# EAGLE schematic i4004-master (EAGLE 6.2), part 1 of 8
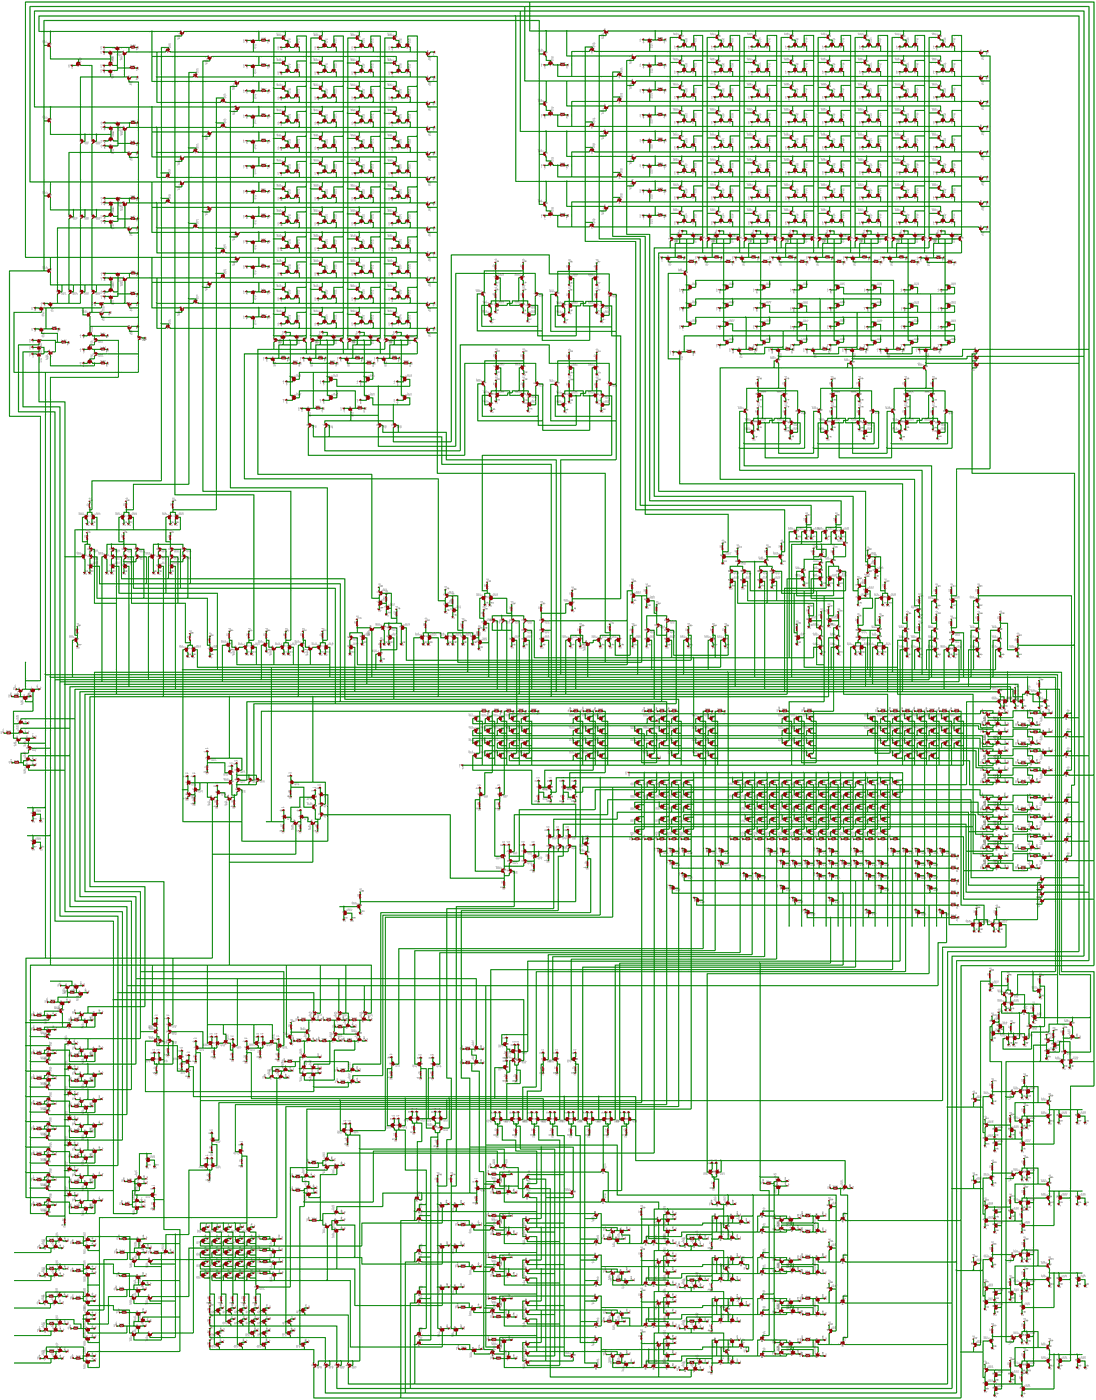
[diagram p0: schematic, sheet 1, overview]
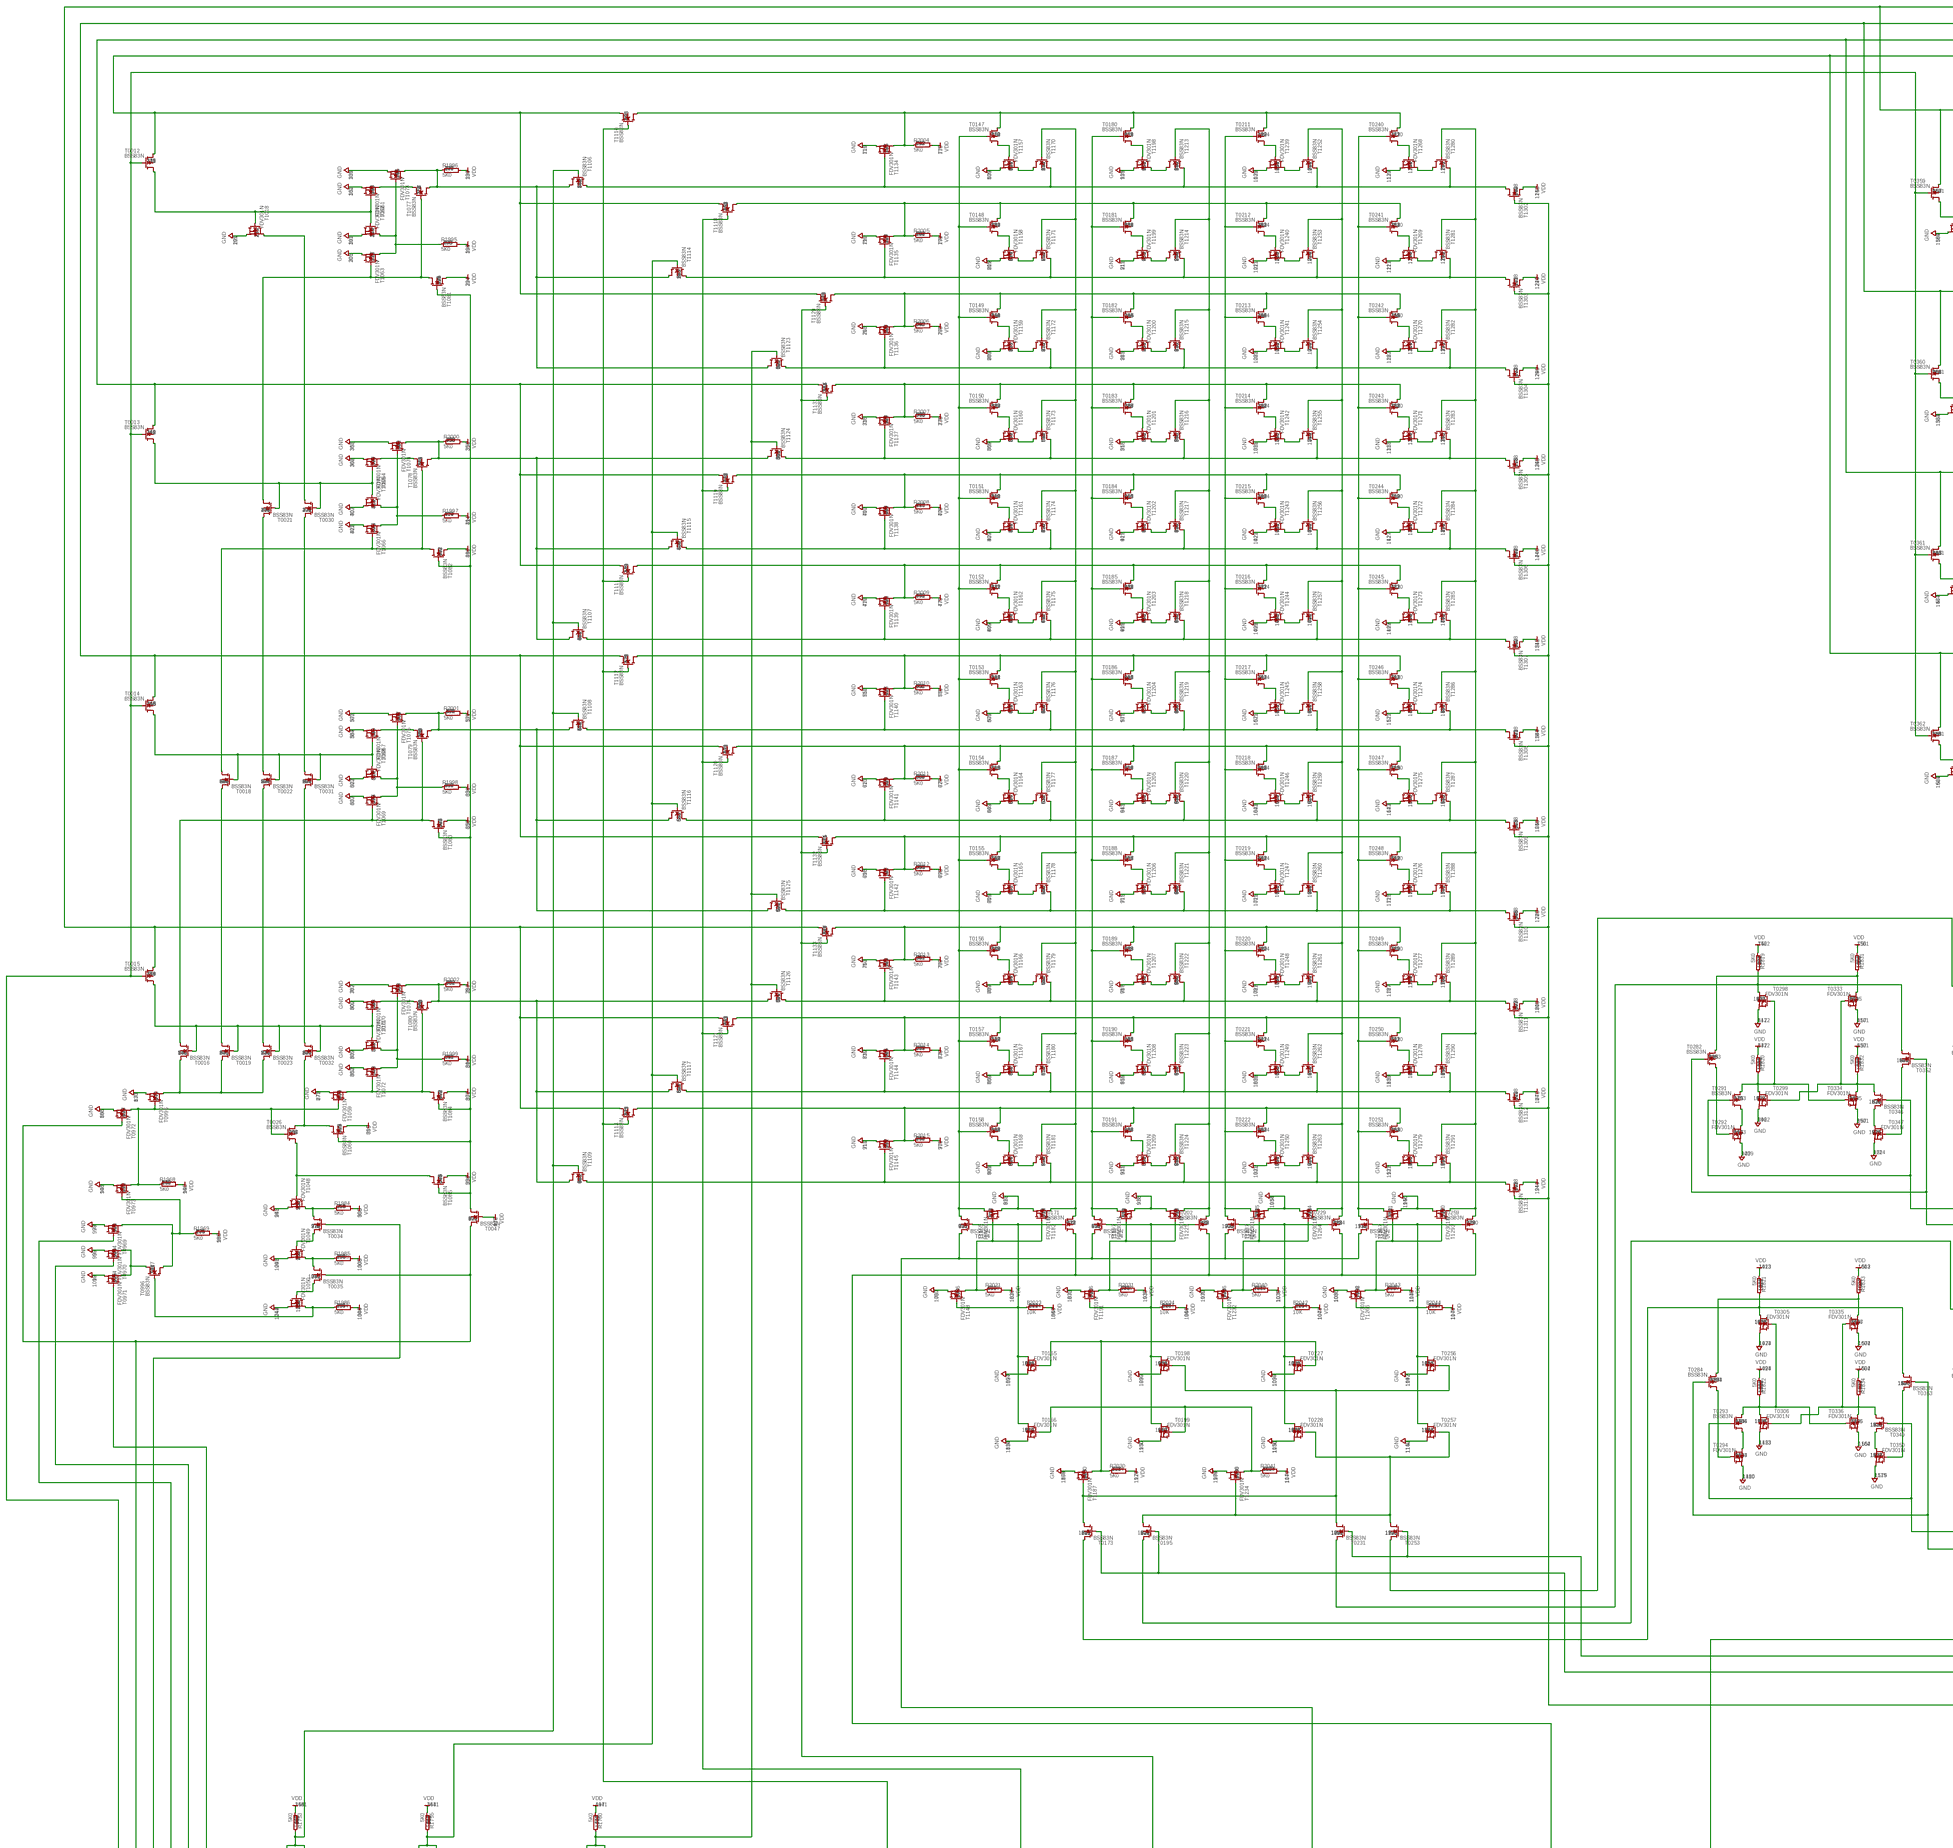
[diagram p1: schematic, sheet 1, part 1 of 6]
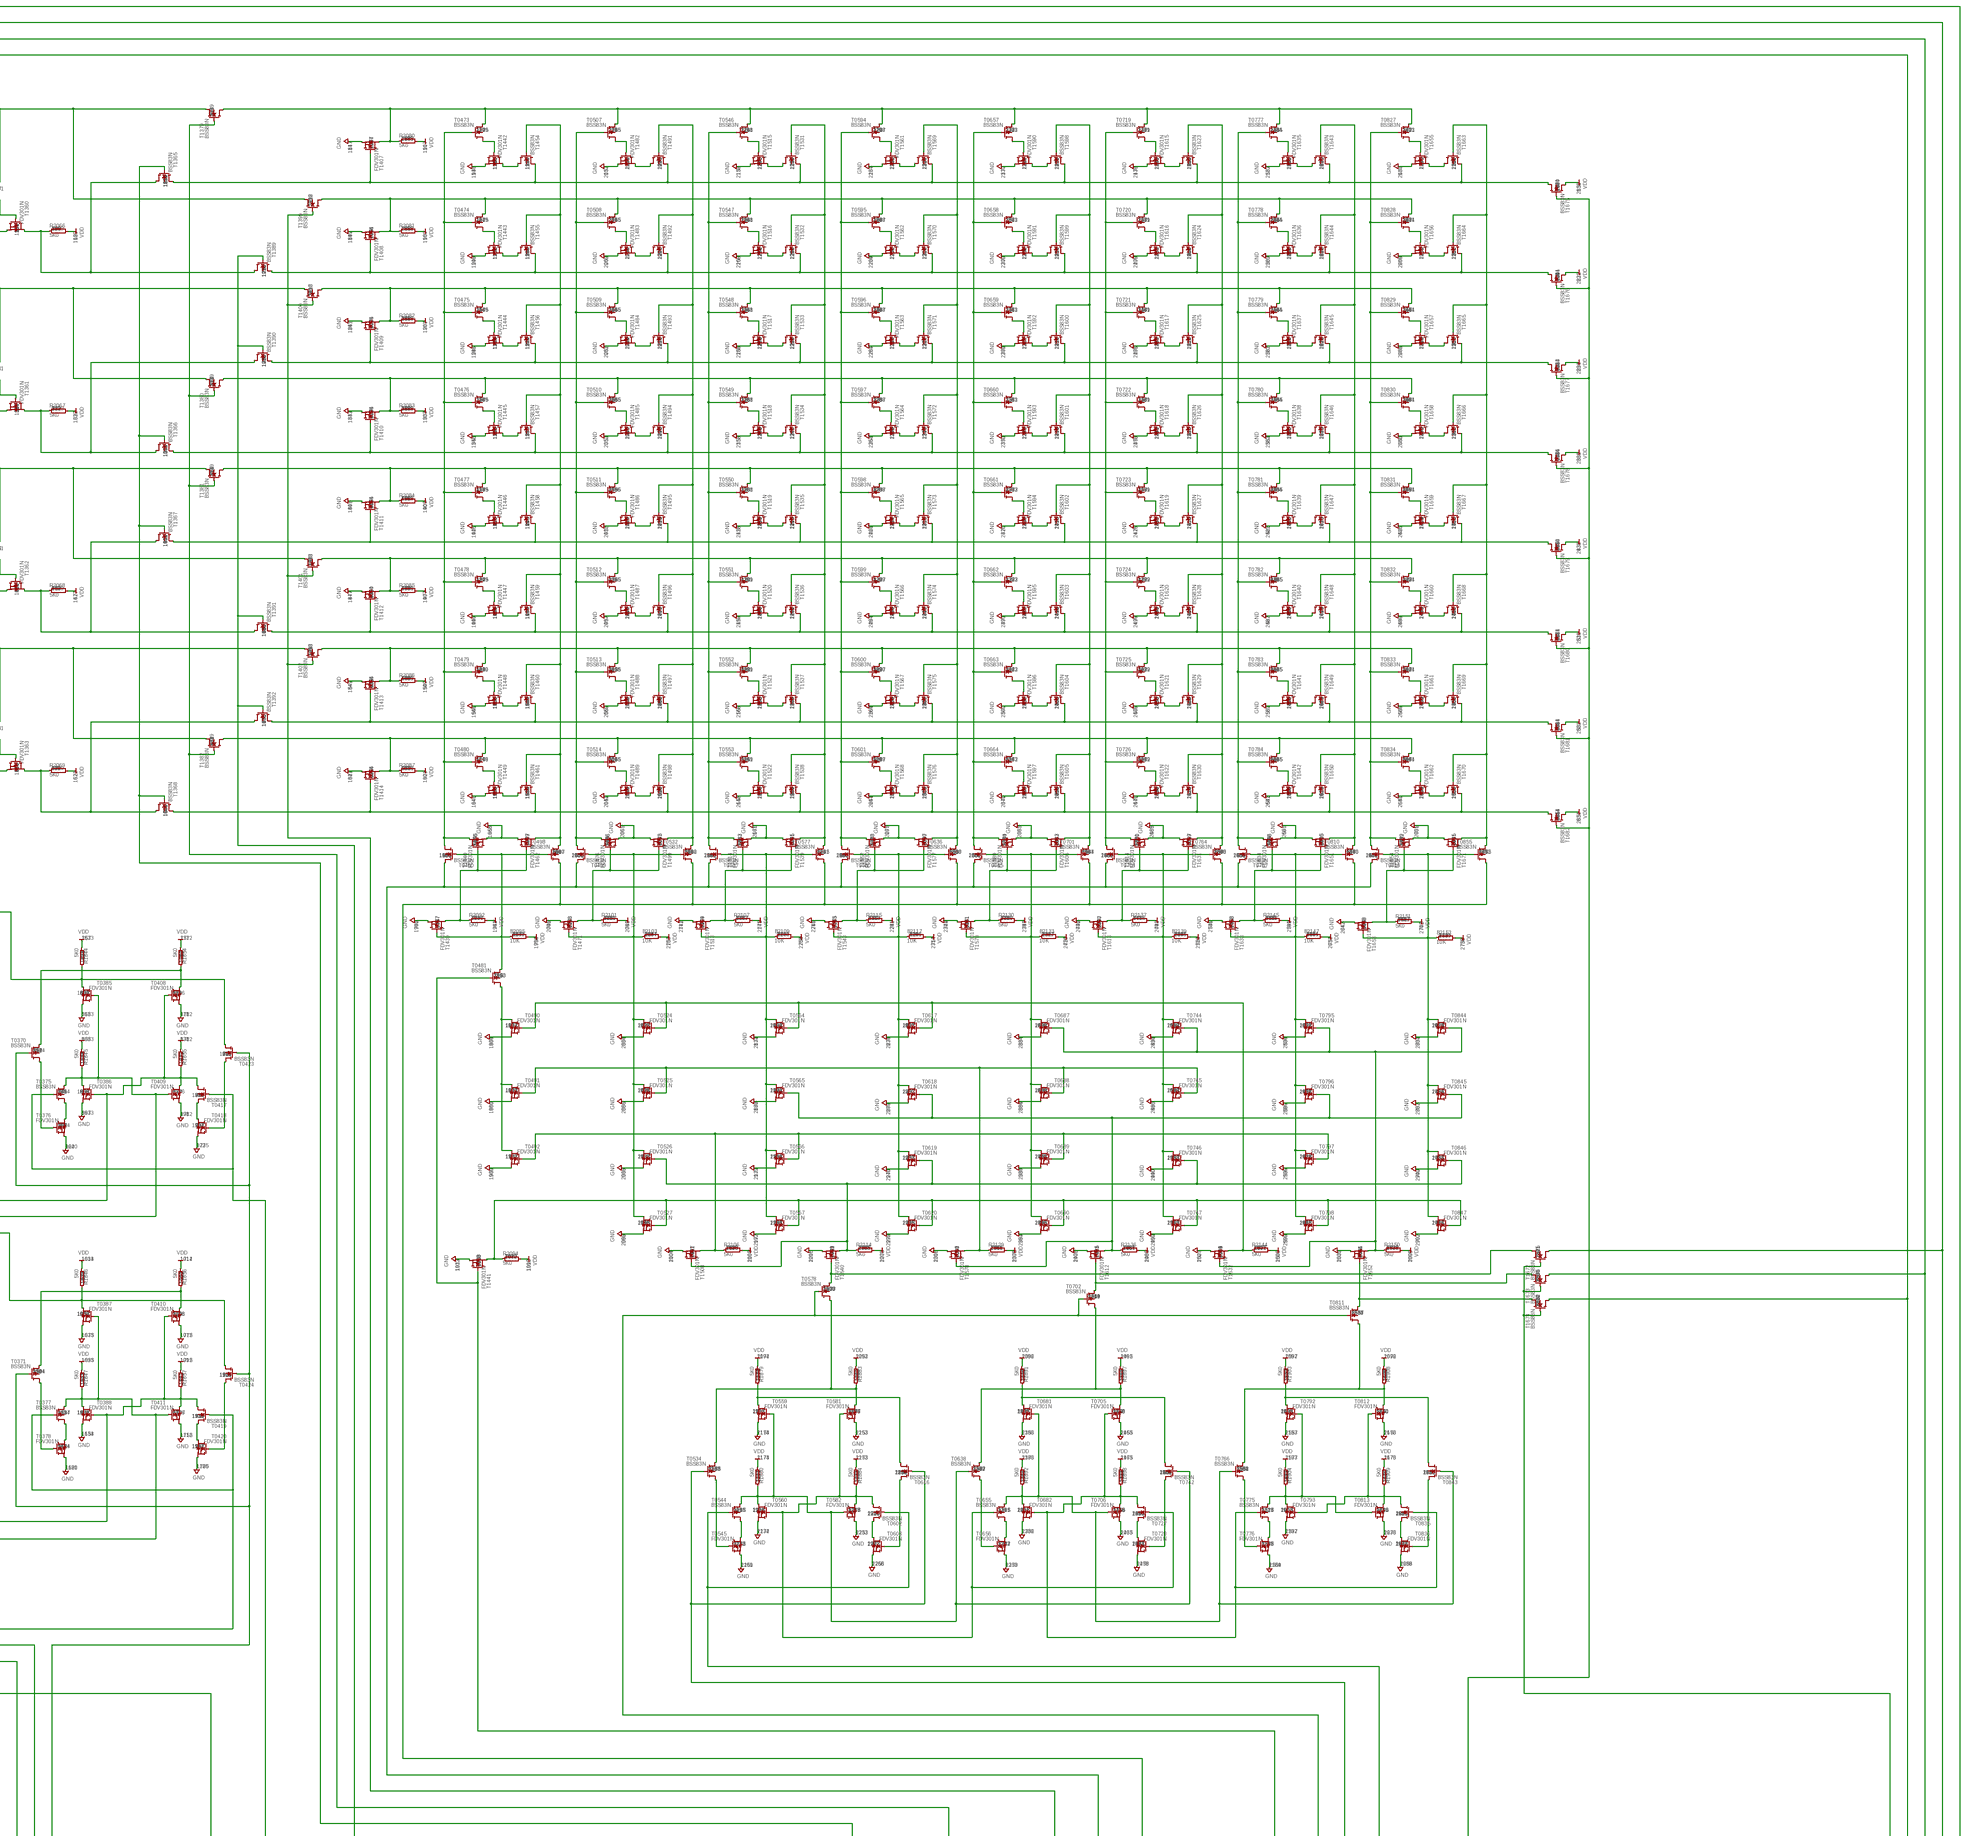
[diagram p2: schematic, sheet 1, part 2 of 6]
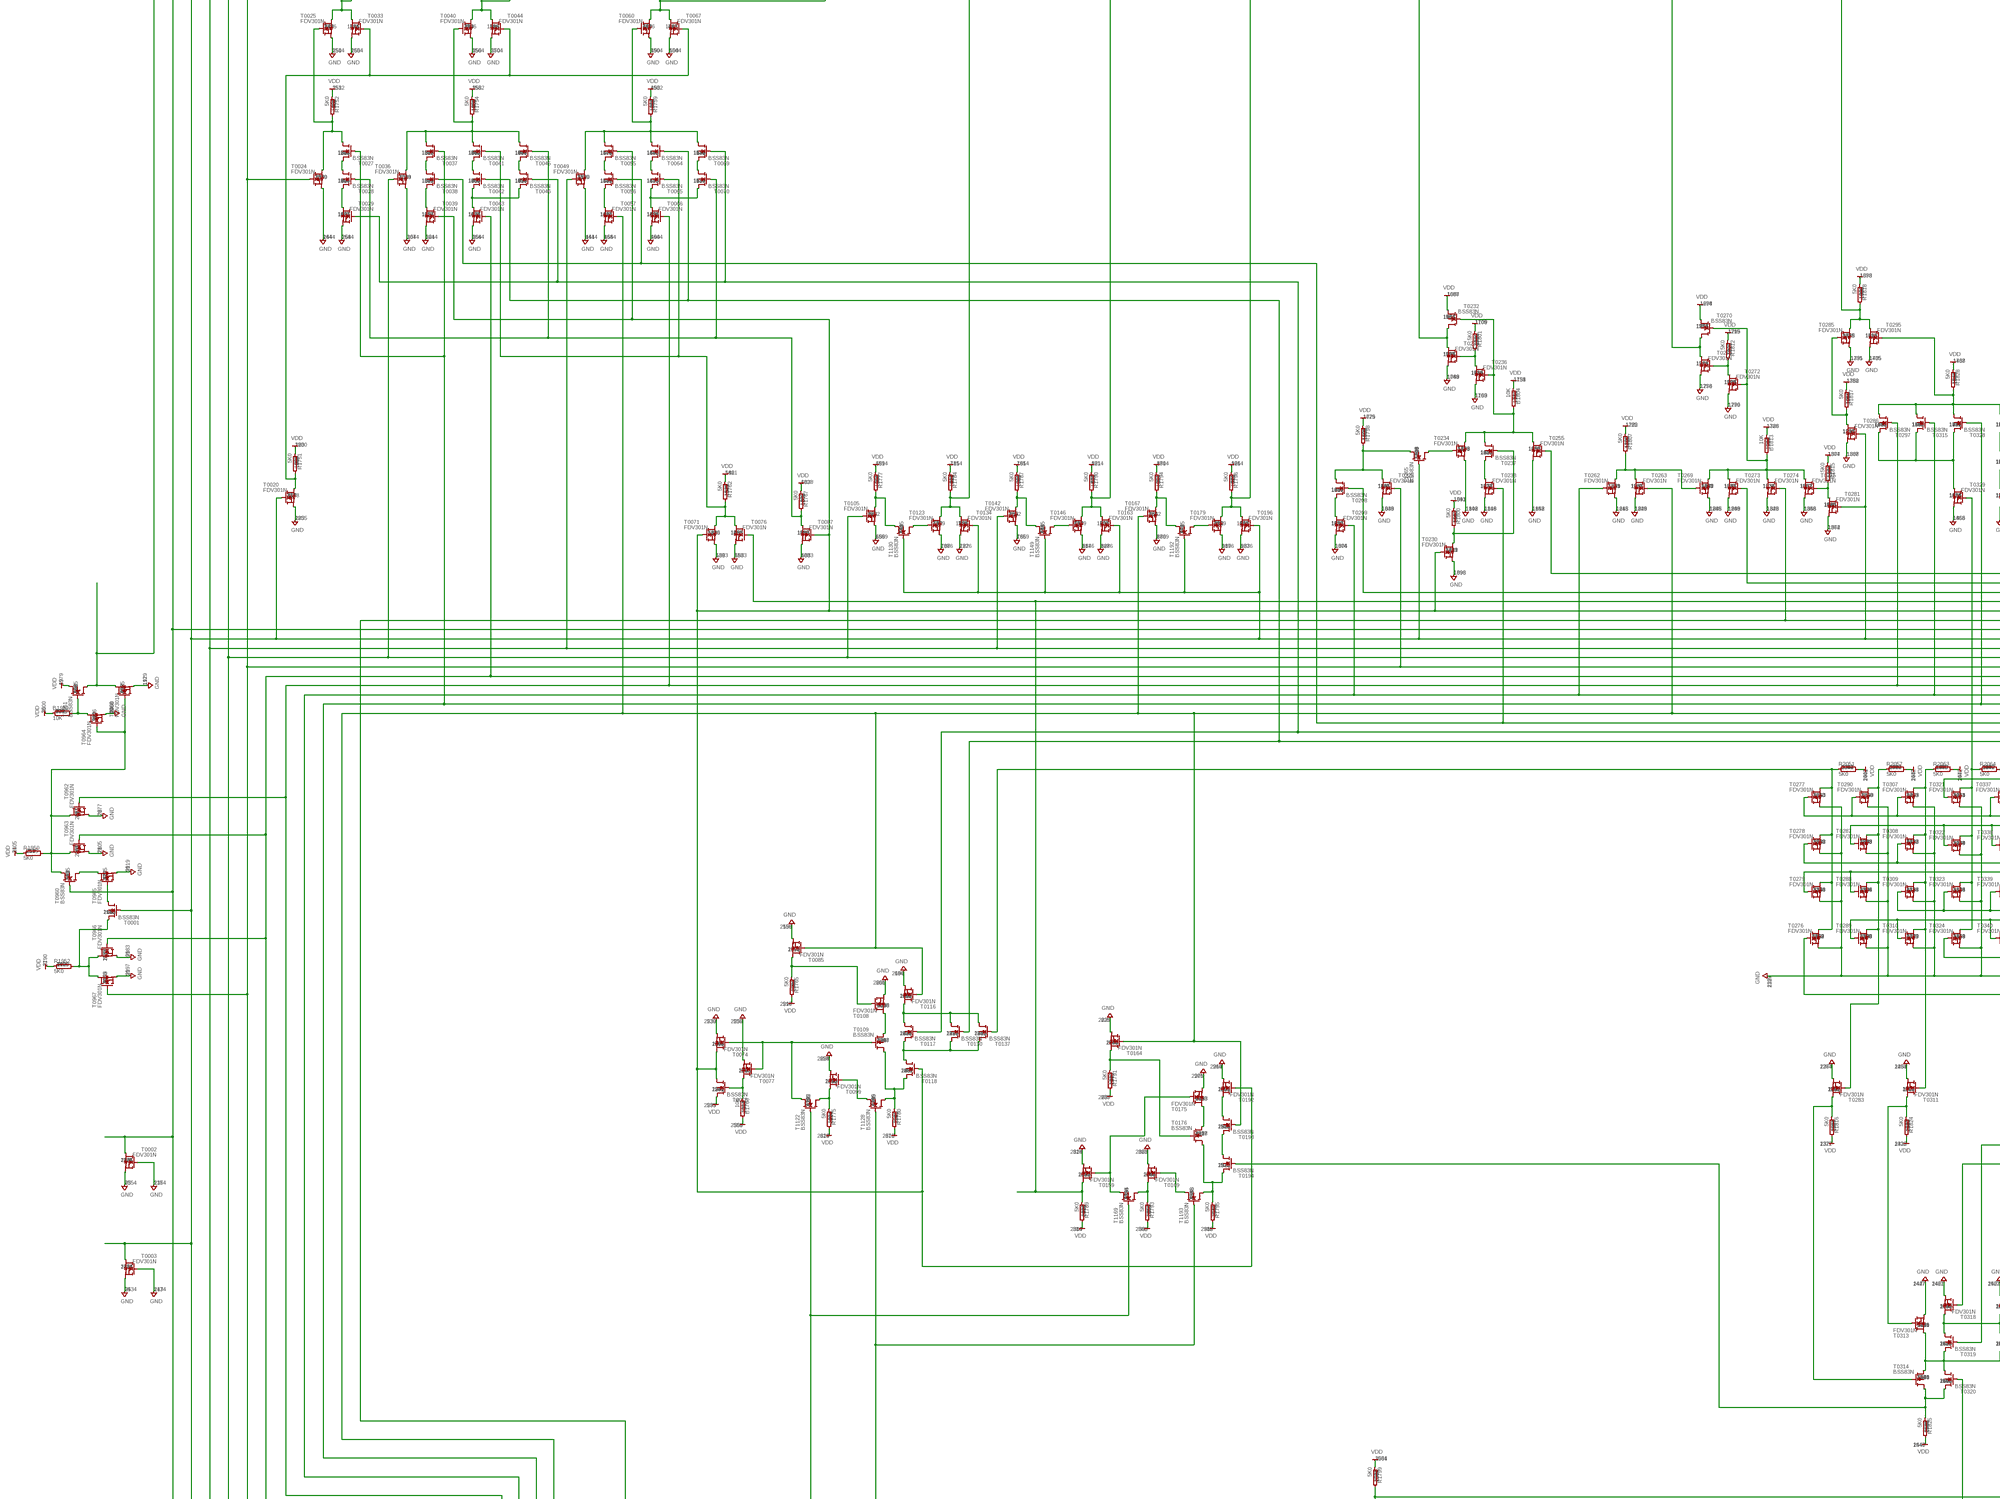
[diagram p3: schematic, sheet 1, part 3 of 6]
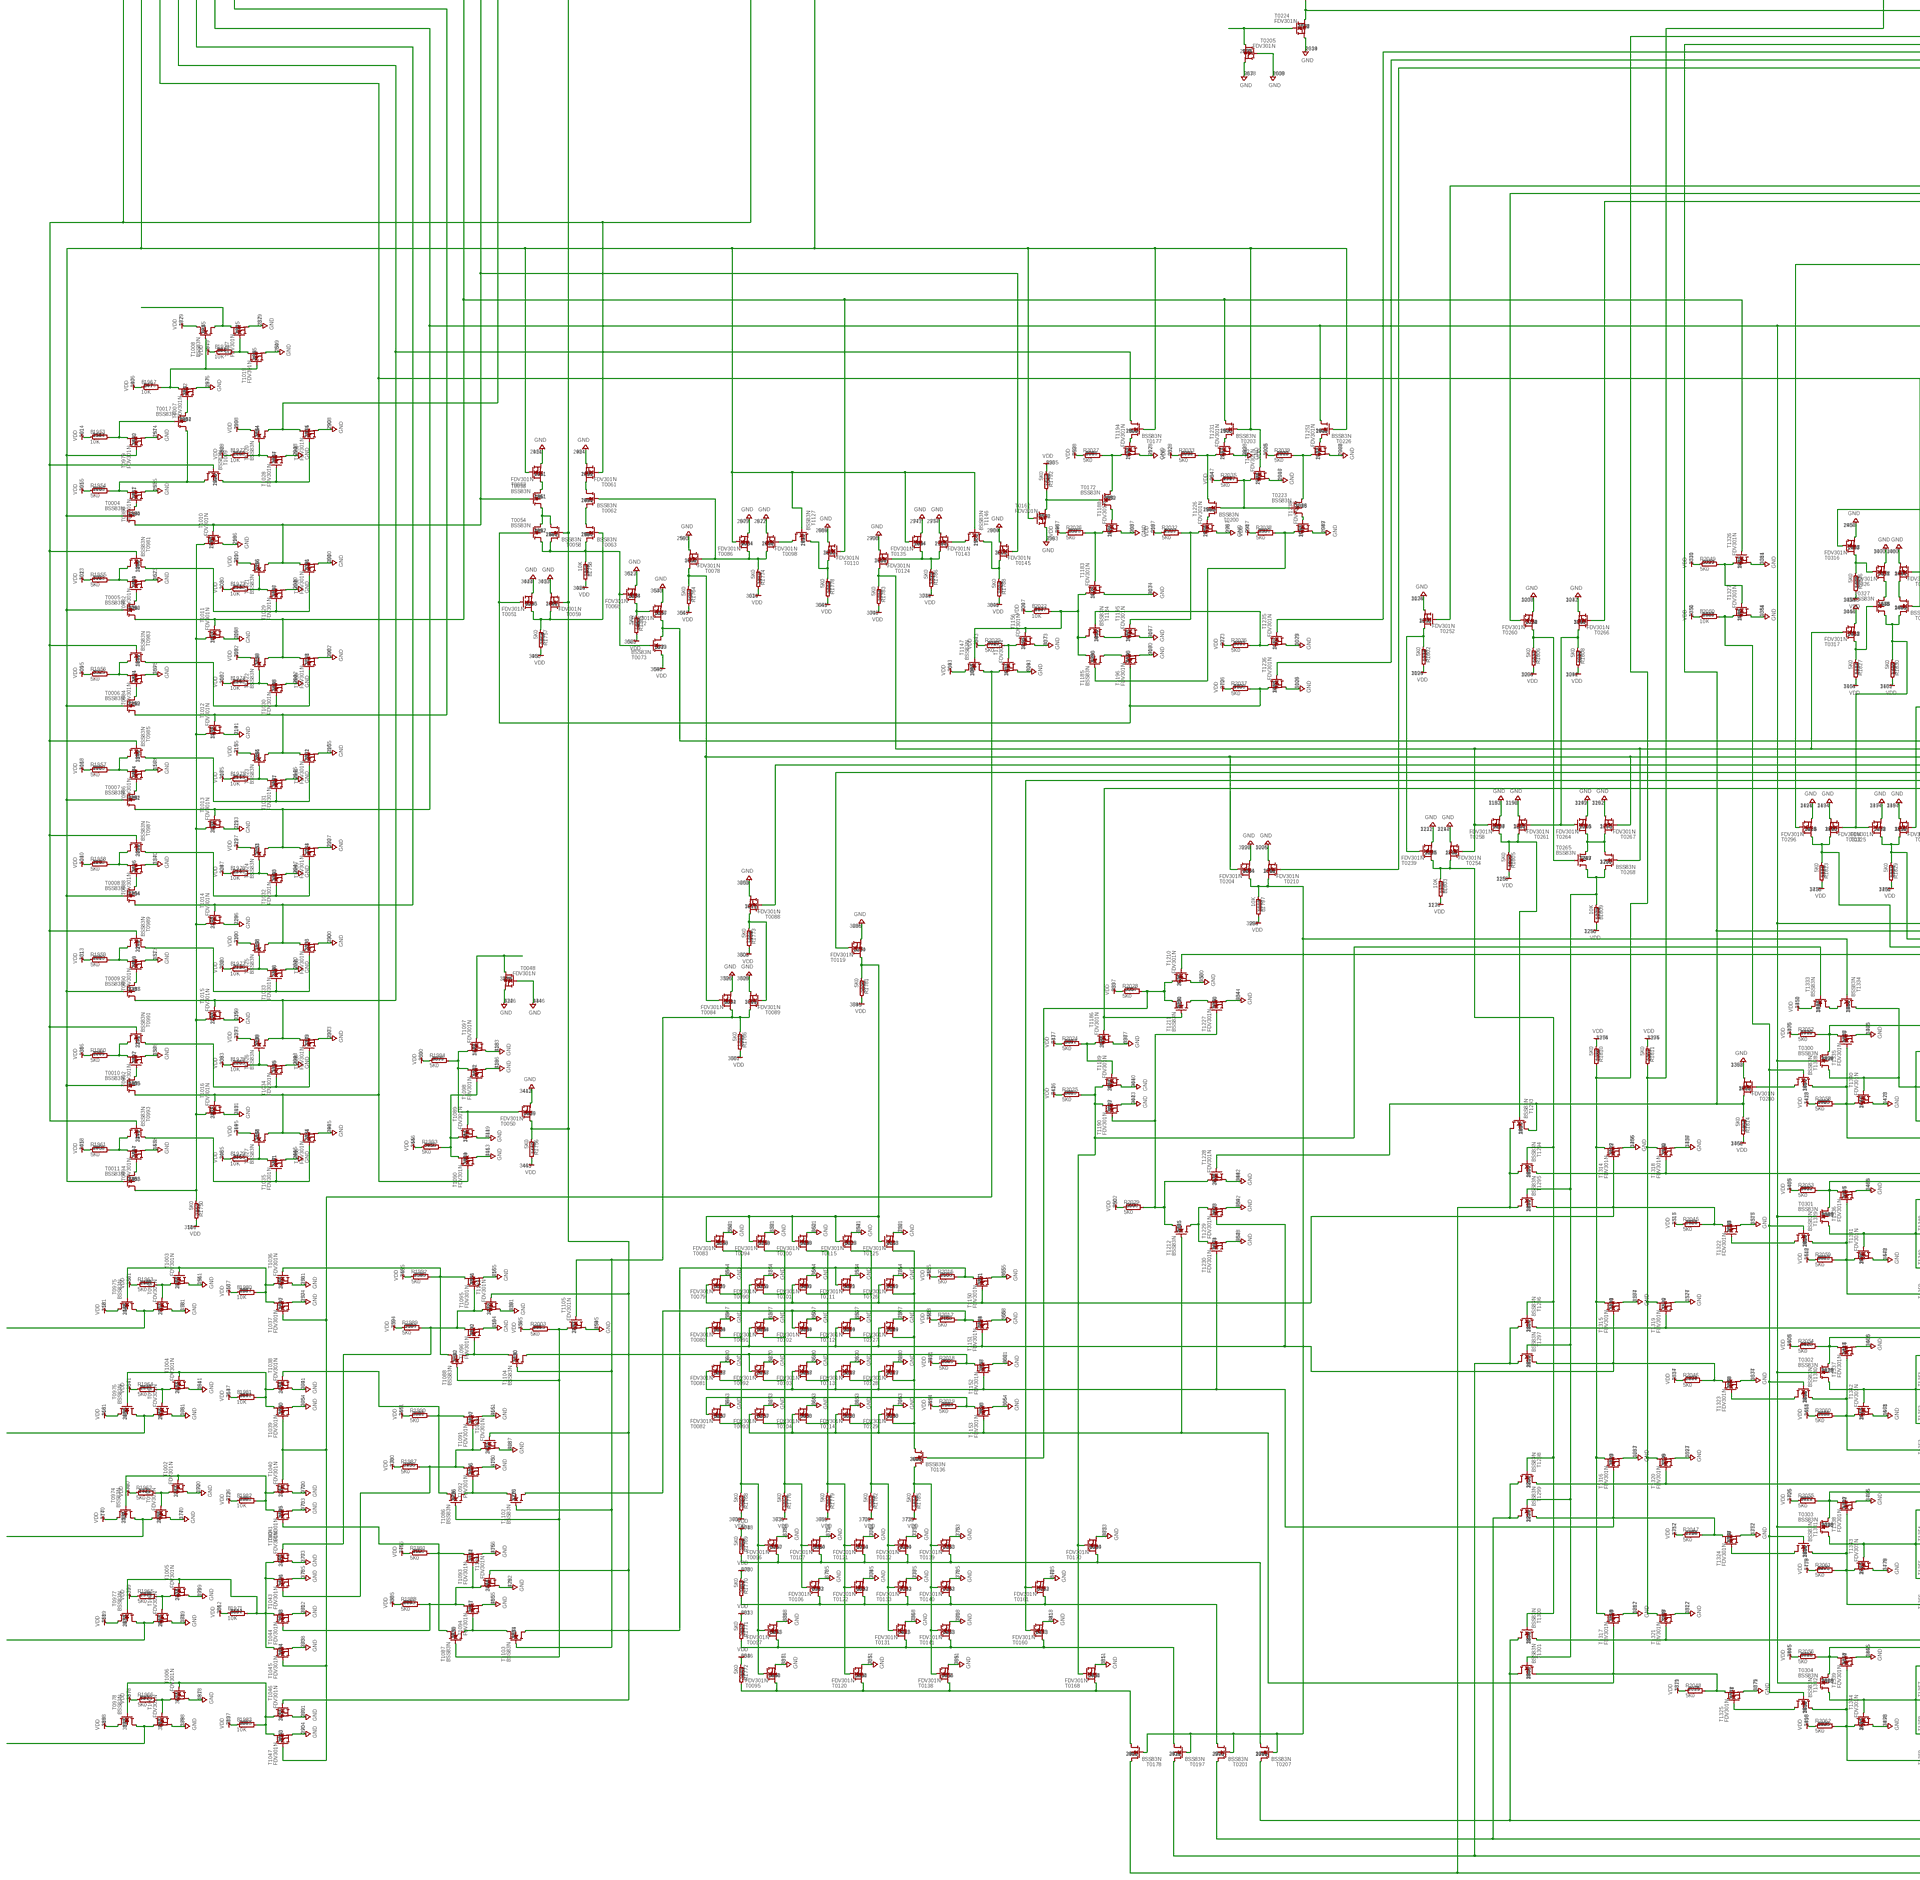
[diagram p4: schematic, sheet 1, part 4 of 6]
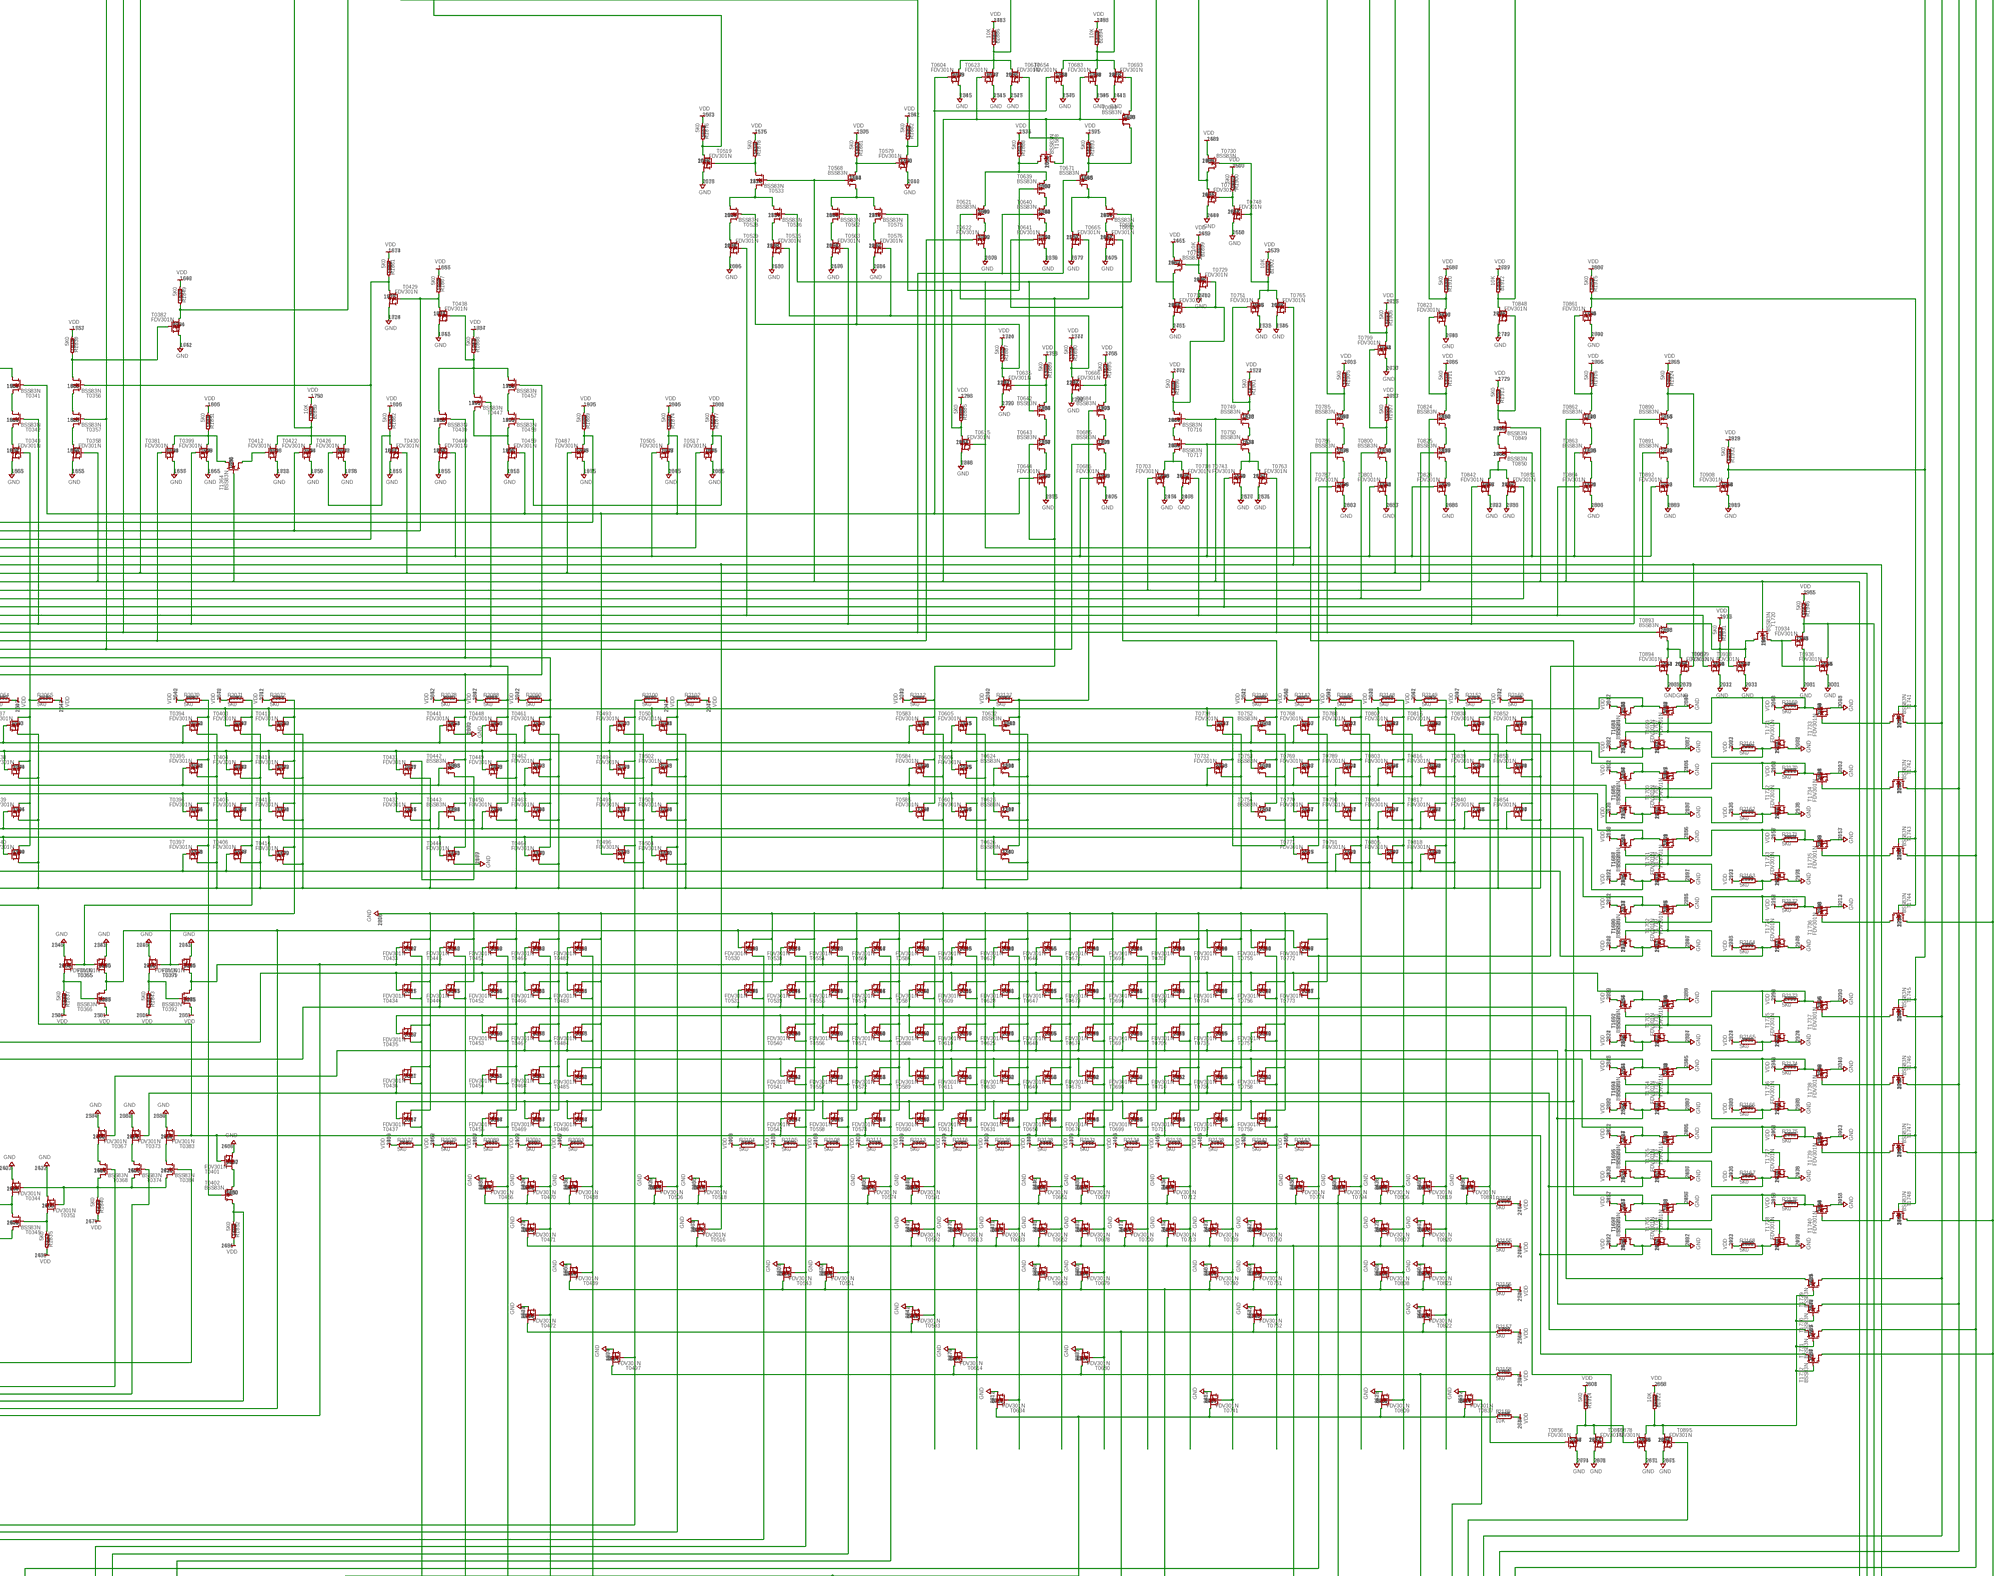
[diagram p5: schematic, sheet 1, part 5 of 6]
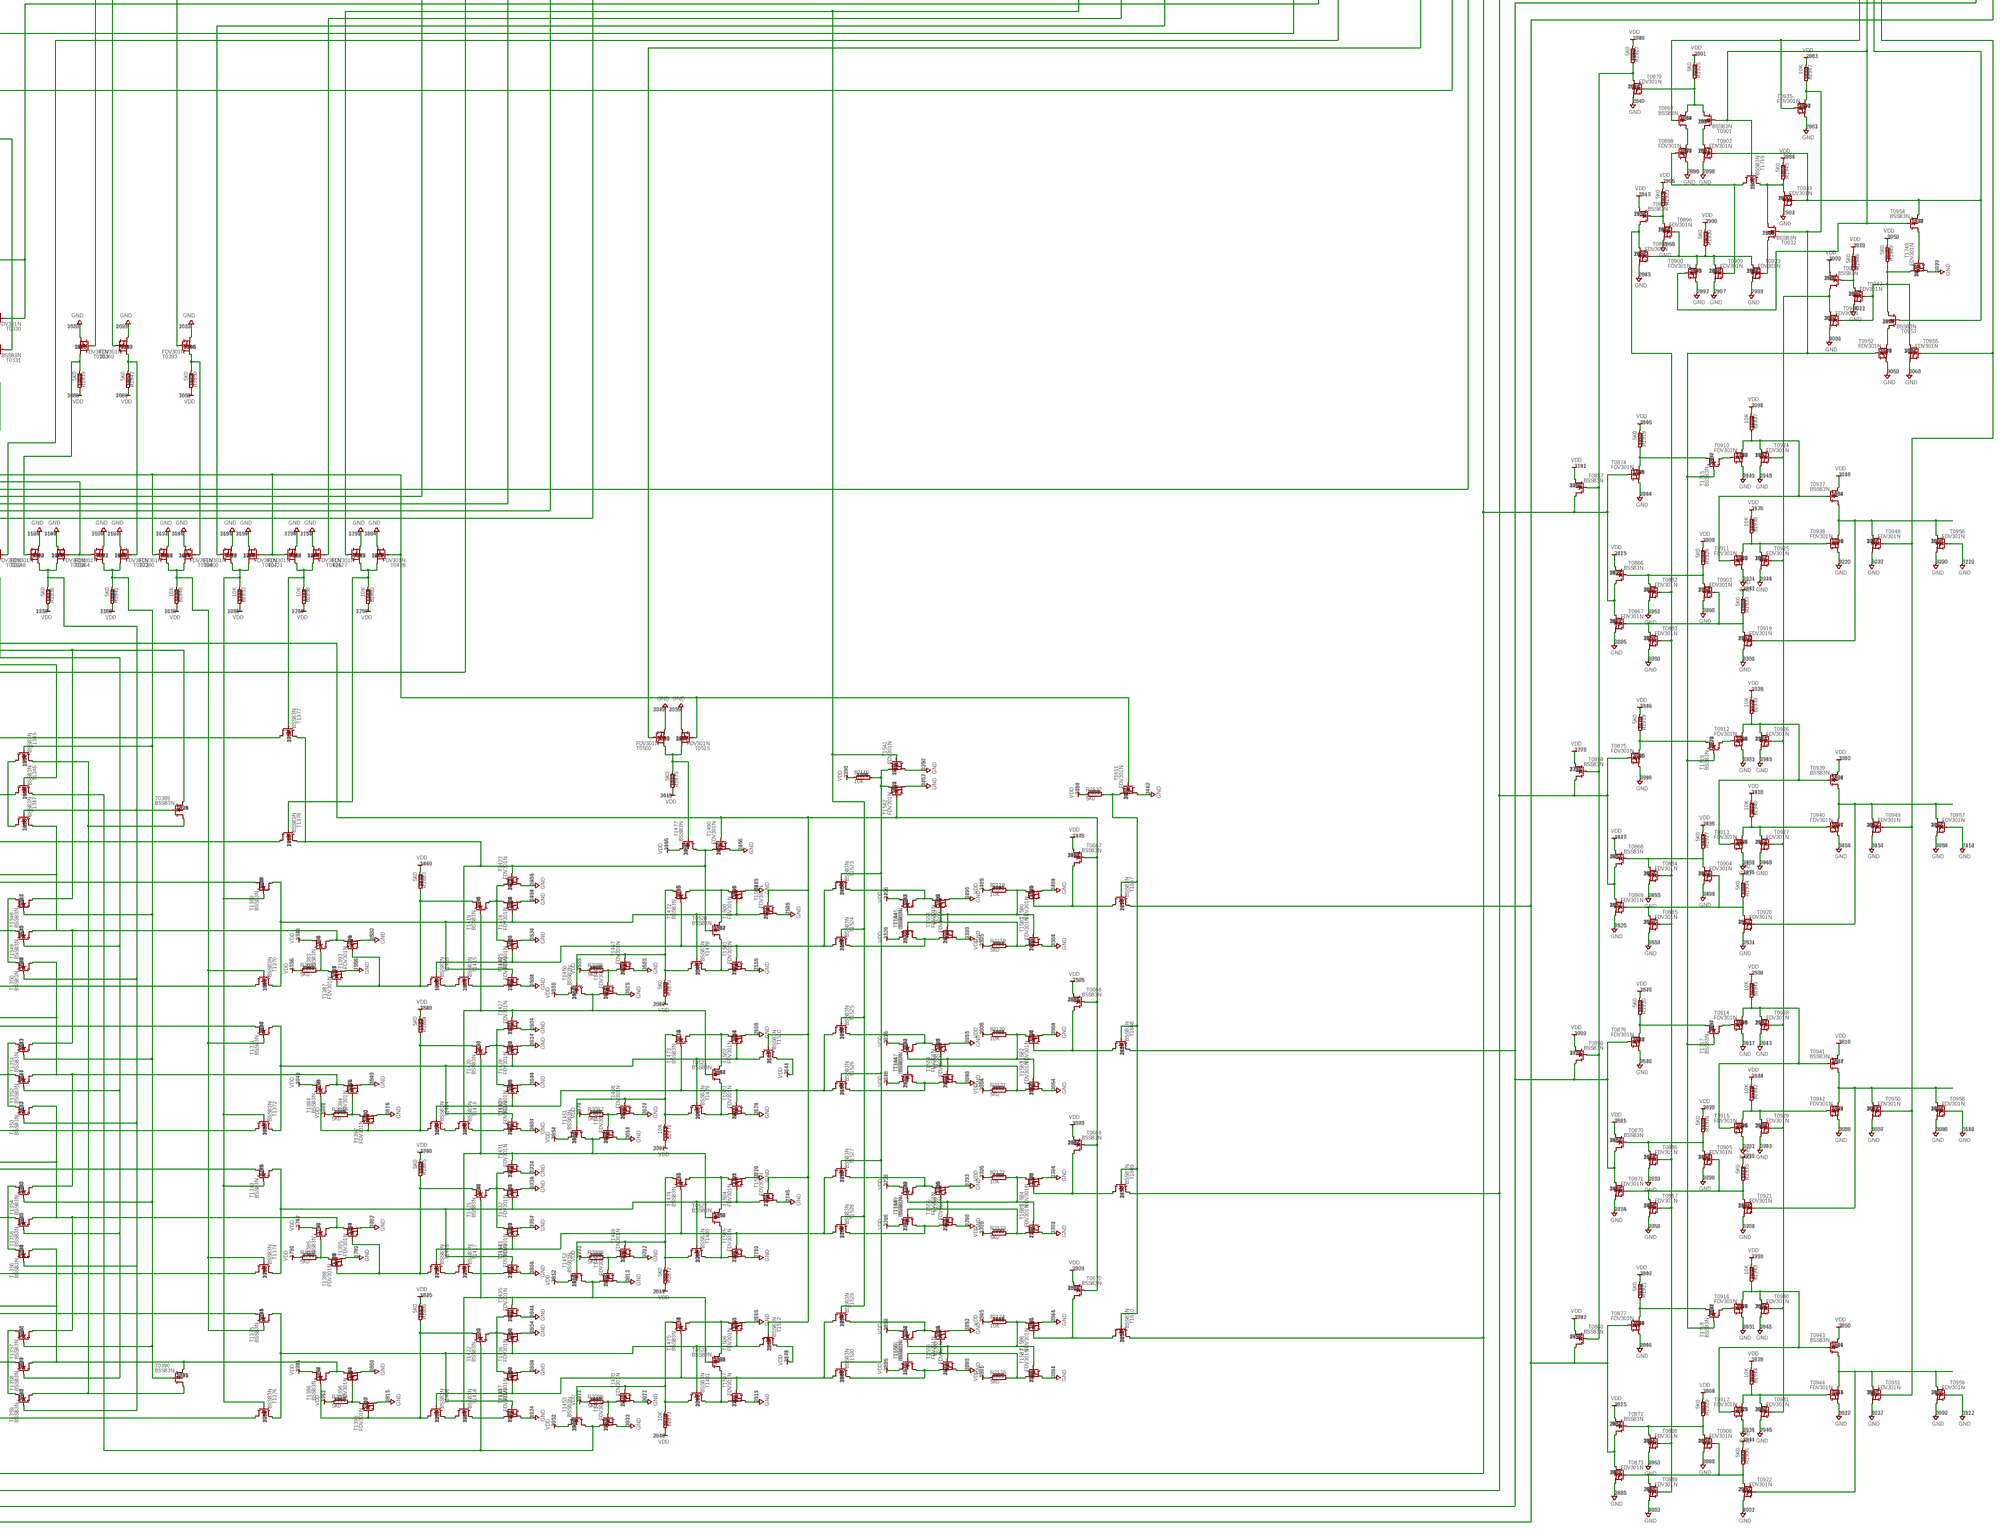
[diagram p6: schematic, sheet 1, part 6 of 6]

## Parts
B1758  10K  R-EU_R0805  [R0805]
B1763  10K  R-EU_R0805  [R0805]
B1797  10K  R-EU_R0805  [R0805]
B1803  10K  R-EU_R0805  [R0805]
B1804  10K  R-EU_R0805  [R0805]
B1809  10K  R-EU_R0805  [R0805]
B1813  10K  R-EU_R0805  [R0805]
B1848  10K  R-EU_R0805  [R0805]
B1853  10K  R-EU_R0805  [R0805]
B1858  10K  R-EU_R0805  [R0805]
B1859  10K  R-EU_R0805  [R0805]
B1860  10K  R-EU_R0805  [R0805]
B1871  10K  R-EU_R0805  [R0805]
B1873  10K  R-EU_R0805  [R0805]
B1886  10K  R-EU_R0805  [R0805]
B1894  10K  R-EU_R0805  [R0805]
B1899  10K  R-EU_R0805  [R0805]
B1902  10K  R-EU_R0805  [R0805]
B1912  10K  R-EU_R0805  [R0805]
B1922  10K  R-EU_R0805  [R0805]
B1937  10K  R-EU_R0805  [R0805]
B1938  10K  R-EU_R0805  [R0805]
B1939  10K  R-EU_R0805  [R0805]
B1940  10K  R-EU_R0805  [R0805]
B1941  10K  R-EU_R0805  [R0805]
B1942  10K  R-EU_R0805  [R0805]
B1943  10K  R-EU_R0805  [R0805]
B1944  10K  R-EU_R0805  [R0805]
B1947  10K  R-EU_R0805  [R0805]
B1951  10K  R-EU_R0805  [R0805]
B1953  10K  R-EU_R0805  [R0805]
B1967  10K  R-EU_R0805  [R0805]
B1970  10K  R-EU_R0805  [R0805]
B1971  10K  R-EU_R0805  [R0805]
B1972  10K  R-EU_R0805  [R0805]
B1973  10K  R-EU_R0805  [R0805]
B1974  10K  R-EU_R0805  [R0805]
B1975  10K  R-EU_R0805  [R0805]
B1976  10K  R-EU_R0805  [R0805]
B1977  10K  R-EU_R0805  [R0805]
B1978  10K  R-EU_R0805  [R0805]
B1979  10K  R-EU_R0805  [R0805]
B1980  10K  R-EU_R0805  [R0805]
B1981  10K  R-EU_R0805  [R0805]
B1982  10K  R-EU_R0805  [R0805]
B1983  10K  R-EU_R0805  [R0805]
B2022  10K  R-EU_R0805  [R0805]
B2023  10K  R-EU_R0805  [R0805]
B2034  10K  R-EU_R0805  [R0805]
B2042  10K  R-EU_R0805  [R0805]
B2044  10K  R-EU_R0805  [R0805]
B2050  10K  R-EU_R0805  [R0805]
B2095  10K  R-EU_R0805  [R0805]
B2103  10K  R-EU_R0805  [R0805]
B2109  10K  R-EU_R0805  [R0805]
B2110  10K  R-EU_R0805  [R0805]
B2117  10K  R-EU_R0805  [R0805]
B2118  10K  R-EU_R0805  [R0805]
B2120  10K  R-EU_R0805  [R0805]
B2122  10K  R-EU_R0805  [R0805]
B2124  10K  R-EU_R0805  [R0805]
B2133  10K  R-EU_R0805  [R0805]
B2139  10K  R-EU_R0805  [R0805]
B2147  10K  R-EU_R0805  [R0805]
B2153  10K  R-EU_R0805  [R0805]
B2159  10K  R-EU_R0805  [R0805]
R1750  5K0  R-EU_R0805  [R0805]
R1751  5K0  R-EU_R0805  [R0805]
R1752  5K0  R-EU_R0805  [R0805]
R1753  5K0  R-EU_R0805  [R0805]
R1754  5K0  R-EU_R0805  [R0805]
R1755  5K0  R-EU_R0805  [R0805]
R1756  5K0  R-EU_R0805  [R0805]
R1757  5K0  R-EU_R0805  [R0805]
R1759  5K0  R-EU_R0805  [R0805]
R1760  5K0  R-EU_R0805  [R0805]
R1761  5K0  R-EU_R0805  [R0805]
R1762  5K0  R-EU_R0805  [R0805]
R1764  5K0  R-EU_R0805  [R0805]
R1765  5K0  R-EU_R0805  [R0805]
R1766  5K0  R-EU_R0805  [R0805]
R1767  5K0  R-EU_R0805  [R0805]
R1768  5K0  R-EU_R0805  [R0805]
R1769  5K0  R-EU_R0805  [R0805]
R1770  5K0  R-EU_R0805  [R0805]
R1771  5K0  R-EU_R0805  [R0805]
R1772  5K0  R-EU_R0805  [R0805]
R1773  5K0  R-EU_R0805  [R0805]
R1774  5K0  R-EU_R0805  [R0805]
R1775  5K0  R-EU_R0805  [R0805]
R1776  5K0  R-EU_R0805  [R0805]
R1777  5K0  R-EU_R0805  [R0805]
R1778  5K0  R-EU_R0805  [R0805]
R1779  5K0  R-EU_R0805  [R0805]
R1780  5K0  R-EU_R0805  [R0805]
R1781  5K0  R-EU_R0805  [R0805]
R1782  5K0  R-EU_R0805  [R0805]
R1783  5K0  R-EU_R0805  [R0805]
R1784  5K0  R-EU_R0805  [R0805]
R1785  5K0  R-EU_R0805  [R0805]
R1786  5K0  R-EU_R0805  [R0805]
R1787  5K0  R-EU_R0805  [R0805]
R1788  5K0  R-EU_R0805  [R0805]
R1789  5K0  R-EU_R0805  [R0805]
R1790  5K0  R-EU_R0805  [R0805]
R1791  5K0  R-EU_R0805  [R0805]
R1792  5K0  R-EU_R0805  [R0805]
R1793  5K0  R-EU_R0805  [R0805]
R1794  5K0  R-EU_R0805  [R0805]
R1795  5K0  R-EU_R0805  [R0805]
R1796  5K0  R-EU_R0805  [R0805]
R1798  5K0  R-EU_R0805  [R0805]
R1799  5K0  R-EU_R0805  [R0805]
R1800  5K0  R-EU_R0805  [R0805]
R1801  5K0  R-EU_R0805  [R0805]
R1802  5K0  R-EU_R0805  [R0805]
R1805  5K0  R-EU_R0805  [R0805]
R1806  5K0  R-EU_R0805  [R0805]
R1807  5K0  R-EU_R0805  [R0805]
R1808  5K0  R-EU_R0805  [R0805]
R1810  5K0  R-EU_R0805  [R0805]
R1811  5K0  R-EU_R0805  [R0805]
R1812  5K0  R-EU_R0805  [R0805]
R1814  5K0  R-EU_R0805  [R0805]
R1815  5K0  R-EU_R0805  [R0805]
R1816  5K0  R-EU_R0805  [R0805]
R1817  5K0  R-EU_R0805  [R0805]
R1818  5K0  R-EU_R0805  [R0805]
R1819  5K0  R-EU_R0805  [R0805]
R1820  5K0  R-EU_R0805  [R0805]
R1821  5K0  R-EU_R0805  [R0805]
R1822  5K0  R-EU_R0805  [R0805]
R1823  5K0  R-EU_R0805  [R0805]
R1824  5K0  R-EU_R0805  [R0805]
R1825  5K0  R-EU_R0805  [R0805]
R1826  5K0  R-EU_R0805  [R0805]
R1827  5K0  R-EU_R0805  [R0805]
R1828  5K0  R-EU_R0805  [R0805]
R1829  5K0  R-EU_R0805  [R0805]
R1830  5K0  R-EU_R0805  [R0805]
R1831  5K0  R-EU_R0805  [R0805]
R1832  5K0  R-EU_R0805  [R0805]
R1833  5K0  R-EU_R0805  [R0805]
R1834  5K0  R-EU_R0805  [R0805]
R1835  5K0  R-EU_R0805  [R0805]
R1836  5K0  R-EU_R0805  [R0805]
R1837  5K0  R-EU_R0805  [R0805]
R1838  5K0  R-EU_R0805  [R0805]
R1839  5K0  R-EU_R0805  [R0805]
R1840  5K0  R-EU_R0805  [R0805]
R1841  5K0  R-EU_R0805  [R0805]
R1842  5K0  R-EU_R0805  [R0805]
R1843  5K0  R-EU_R0805  [R0805]
R1844  5K0  R-EU_R0805  [R0805]
R1845  5K0  R-EU_R0805  [R0805]
R1846  5K0  R-EU_R0805  [R0805]
R1847  5K0  R-EU_R0805  [R0805]
R1849  5K0  R-EU_R0805  [R0805]
R1850  5K0  R-EU_R0805  [R0805]
R1851  5K0  R-EU_R0805  [R0805]
R1852  5K0  R-EU_R0805  [R0805]
R1854  5K0  R-EU_R0805  [R0805]
R1855  5K0  R-EU_R0805  [R0805]
R1856  5K0  R-EU_R0805  [R0805]
R1857  5K0  R-EU_R0805  [R0805]
R1861  5K0  R-EU_R0805  [R0805]
R1862  5K0  R-EU_R0805  [R0805]
R1863  5K0  R-EU_R0805  [R0805]
R1864  5K0  R-EU_R0805  [R0805]
R1865  5K0  R-EU_R0805  [R0805]
R1866  5K0  R-EU_R0805  [R0805]
R1867  5K0  R-EU_R0805  [R0805]
R1868  5K0  R-EU_R0805  [R0805]
R1869  5K0  R-EU_R0805  [R0805]
R1870  5K0  R-EU_R0805  [R0805]
R1872  5K0  R-EU_R0805  [R0805]
R1874  5K0  R-EU_R0805  [R0805]
R1875  5K0  R-EU_R0805  [R0805]
R1876  5K0  R-EU_R0805  [R0805]
R1877  5K0  R-EU_R0805  [R0805]
R1878  5K0  R-EU_R0805  [R0805]
R1879  5K0  R-EU_R0805  [R0805]
R1880  5K0  R-EU_R0805  [R0805]
R1881  5K0  R-EU_R0805  [R0805]
R1882  5K0  R-EU_R0805  [R0805]
R1883  5K0  R-EU_R0805  [R0805]
R1884  5K0  R-EU_R0805  [R0805]
R1885  5K0  R-EU_R0805  [R0805]
R1887  5K0  R-EU_R0805  [R0805]
R1888  5K0  R-EU_R0805  [R0805]
R1889  5K0  R-EU_R0805  [R0805]
R1890  5K0  R-EU_R0805  [R0805]
R1891  5K0  R-EU_R0805  [R0805]
R1892  5K0  R-EU_R0805  [R0805]
R1893  5K0  R-EU_R0805  [R0805]
R1895  5K0  R-EU_R0805  [R0805]
R1896  5K0  R-EU_R0805  [R0805]
R1897  5K0  R-EU_R0805  [R0805]
R1898  5K0  R-EU_R0805  [R0805]
R1900  5K0  R-EU_R0805  [R0805]
R1901  5K0  R-EU_R0805  [R0805]
R1903  5K0  R-EU_R0805  [R0805]
R1904  5K0  R-EU_R0805  [R0805]
R1905  5K0  R-EU_R0805  [R0805]
R1906  5K0  R-EU_R0805  [R0805]
R1907  5K0  R-EU_R0805  [R0805]
R1908  5K0  R-EU_R0805  [R0805]
R1909  5K0  R-EU_R0805  [R0805]
R1910  5K0  R-EU_R0805  [R0805]
R1911  5K0  R-EU_R0805  [R0805]
R1913  5K0  R-EU_R0805  [R0805]
R1914  5K0  R-EU_R0805  [R0805]
R1915  5K0  R-EU_R0805  [R0805]
R1916  5K0  R-EU_R0805  [R0805]
R1917  5K0  R-EU_R0805  [R0805]
R1918  5K0  R-EU_R0805  [R0805]
R1919  5K0  R-EU_R0805  [R0805]
R1920  5K0  R-EU_R0805  [R0805]
R1921  5K0  R-EU_R0805  [R0805]
R1923  5K0  R-EU_R0805  [R0805]
R1924  5K0  R-EU_R0805  [R0805]
R1925  5K0  R-EU_R0805  [R0805]
R1926  5K0  R-EU_R0805  [R0805]
R1927  5K0  R-EU_R0805  [R0805]
R1928  5K0  R-EU_R0805  [R0805]
R1929  5K0  R-EU_R0805  [R0805]
R1930  5K0  R-EU_R0805  [R0805]
R1931  5K0  R-EU_R0805  [R0805]
R1932  5K0  R-EU_R0805  [R0805]
R1933  5K0  R-EU_R0805  [R0805]
R1934  5K0  R-EU_R0805  [R0805]
R1935  5K0  R-EU_R0805  [R0805]
R1936  5K0  R-EU_R0805  [R0805]
R1945  5K0  R-EU_R0805  [R0805]
R1946  5K0  R-EU_R0805  [R0805]
R1948  5K0  R-EU_R0805  [R0805]
R1949  5K0  R-EU_R0805  [R0805]
R1950  5K0  R-EU_R0805  [R0805]
R1952  5K0  R-EU_R0805  [R0805]
R1954  5K0  R-EU_R0805  [R0805]
R1955  5K0  R-EU_R0805  [R0805]
R1956  5K0  R-EU_R0805  [R0805]
R1957  5K0  R-EU_R0805  [R0805]
R1958  5K0  R-EU_R0805  [R0805]
R1959  5K0  R-EU_R0805  [R0805]
R1960  5K0  R-EU_R0805  [R0805]
R1961  5K0  R-EU_R0805  [R0805]
R1962  5K0  R-EU_R0805  [R0805]
R1963  5K0  R-EU_R0805  [R0805]
R1964  5K0  R-EU_R0805  [R0805]
R1965  5K0  R-EU_R0805  [R0805]
R1966  5K0  R-EU_R0805  [R0805]
R1968  5K0  R-EU_R0805  [R0805]
R1969  5K0  R-EU_R0805  [R0805]
R1984  5K0  R-EU_R0805  [R0805]
R1985  5K0  R-EU_R0805  [R0805]
R1986  5K0  R-EU_R0805  [R0805]
R1987  5K0  R-EU_R0805  [R0805]
R1988  5K0  R-EU_R0805  [R0805]
R1989  5K0  R-EU_R0805  [R0805]
R1990  5K0  R-EU_R0805  [R0805]
R1991  5K0  R-EU_R0805  [R0805]
R1992  5K0  R-EU_R0805  [R0805]
R1993  5K0  R-EU_R0805  [R0805]
R1994  5K0  R-EU_R0805  [R0805]
R1995  5K0  R-EU_R0805  [R0805]
R1996  5K0  R-EU_R0805  [R0805]
R1997  5K0  R-EU_R0805  [R0805]
R1998  5K0  R-EU_R0805  [R0805]
R1999  5K0  R-EU_R0805  [R0805]
R2000  5K0  R-EU_R0805  [R0805]
R2001  5K0  R-EU_R0805  [R0805]
R2002  5K0  R-EU_R0805  [R0805]
R2003  5K0  R-EU_R0805  [R0805]
R2004  5K0  R-EU_R0805  [R0805]
R2005  5K0  R-EU_R0805  [R0805]
R2006  5K0  R-EU_R0805  [R0805]
R2007  5K0  R-EU_R0805  [R0805]
R2008  5K0  R-EU_R0805  [R0805]
R2009  5K0  R-EU_R0805  [R0805]
R2010  5K0  R-EU_R0805  [R0805]
R2011  5K0  R-EU_R0805  [R0805]
R2012  5K0  R-EU_R0805  [R0805]
R2013  5K0  R-EU_R0805  [R0805]
R2014  5K0  R-EU_R0805  [R0805]
R2015  5K0  R-EU_R0805  [R0805]
R2016  5K0  R-EU_R0805  [R0805]
R2017  5K0  R-EU_R0805  [R0805]
R2018  5K0  R-EU_R0805  [R0805]
R2019  5K0  R-EU_R0805  [R0805]
R2020  5K0  R-EU_R0805  [R0805]
R2021  5K0  R-EU_R0805  [R0805]
R2024  5K0  R-EU_R0805  [R0805]
R2025  5K0  R-EU_R0805  [R0805]
R2026  5K0  R-EU_R0805  [R0805]
R2027  5K0  R-EU_R0805  [R0805]
R2028  5K0  R-EU_R0805  [R0805]
R2029  5K0  R-EU_R0805  [R0805]
R2030  5K0  R-EU_R0805  [R0805]
R2031  5K0  R-EU_R0805  [R0805]
R2032  5K0  R-EU_R0805  [R0805]
R2033  5K0  R-EU_R0805  [R0805]
R2035  5K0  R-EU_R0805  [R0805]
R2036  5K0  R-EU_R0805  [R0805]
R2037  5K0  R-EU_R0805  [R0805]
R2038  5K0  R-EU_R0805  [R0805]
R2039  5K0  R-EU_R0805  [R0805]
R2040  5K0  R-EU_R0805  [R0805]
R2041  5K0  R-EU_R0805  [R0805]
R2043  5K0  R-EU_R0805  [R0805]
R2045  5K0  R-EU_R0805  [R0805]
R2046  5K0  R-EU_R0805  [R0805]
R2047  5K0  R-EU_R0805  [R0805]
R2048  5K0  R-EU_R0805  [R0805]
R2049  5K0  R-EU_R0805  [R0805]
R2051  5K0  R-EU_R0805  [R0805]
R2052  5K0  R-EU_R0805  [R0805]
R2053  5K0  R-EU_R0805  [R0805]
R2054  5K0  R-EU_R0805  [R0805]
R2055  5K0  R-EU_R0805  [R0805]
R2056  5K0  R-EU_R0805  [R0805]
R2057  5K0  R-EU_R0805  [R0805]
R2058  5K0  R-EU_R0805  [R0805]
R2059  5K0  R-EU_R0805  [R0805]
R2060  5K0  R-EU_R0805  [R0805]
R2061  5K0  R-EU_R0805  [R0805]
R2062  5K0  R-EU_R0805  [R0805]
R2063  5K0  R-EU_R0805  [R0805]
R2064  5K0  R-EU_R0805  [R0805]
R2065  5K0  R-EU_R0805  [R0805]
R2066  5K0  R-EU_R0805  [R0805]
R2067  5K0  R-EU_R0805  [R0805]
R2068  5K0  R-EU_R0805  [R0805]
R2069  5K0  R-EU_R0805  [R0805]
R2070  5K0  R-EU_R0805  [R0805]
R2071  5K0  R-EU_R0805  [R0805]
R2072  5K0  R-EU_R0805  [R0805]
R2073  5K0  R-EU_R0805  [R0805]
R2074  5K0  R-EU_R0805  [R0805]
R2075  5K0  R-EU_R0805  [R0805]
R2076  5K0  R-EU_R0805  [R0805]
R2077  5K0  R-EU_R0805  [R0805]
R2078  5K0  R-EU_R0805  [R0805]
R2079  5K0  R-EU_R0805  [R0805]
R2080  5K0  R-EU_R0805  [R0805]
R2081  5K0  R-EU_R0805  [R0805]
R2082  5K0  R-EU_R0805  [R0805]
R2083  5K0  R-EU_R0805  [R0805]
R2084  5K0  R-EU_R0805  [R0805]
R2085  5K0  R-EU_R0805  [R0805]
R2086  5K0  R-EU_R0805  [R0805]
R2087  5K0  R-EU_R0805  [R0805]
R2088  5K0  R-EU_R0805  [R0805]
R2089  5K0  R-EU_R0805  [R0805]
R2090  5K0  R-EU_R0805  [R0805]
R2091  5K0  R-EU_R0805  [R0805]
R2092  5K0  R-EU_R0805  [R0805]
R2093  5K0  R-EU_R0805  [R0805]
R2094  5K0  R-EU_R0805  [R0805]
R2096  5K0  R-EU_R0805  [R0805]
R2097  5K0  R-EU_R0805  [R0805]
R2098  5K0  R-EU_R0805  [R0805]
R2099  5K0  R-EU_R0805  [R0805]
R2100  5K0  R-EU_R0805  [R0805]
R2101  5K0  R-EU_R0805  [R0805]
R2102  5K0  R-EU_R0805  [R0805]
R2104  5K0  R-EU_R0805  [R0805]
R2105  5K0  R-EU_R0805  [R0805]
R2106  5K0  R-EU_R0805  [R0805]
R2107  5K0  R-EU_R0805  [R0805]
R2108  5K0  R-EU_R0805  [R0805]
R2111  5K0  R-EU_R0805  [R0805]
R2112  5K0  R-EU_R0805  [R0805]
R2113  5K0  R-EU_R0805  [R0805]
R2114  5K0  R-EU_R0805  [R0805]
R2115  5K0  R-EU_R0805  [R0805]
R2116  5K0  R-EU_R0805  [R0805]
R2119  5K0  R-EU_R0805  [R0805]
R2121  5K0  R-EU_R0805  [R0805]
R2123  5K0  R-EU_R0805  [R0805]
R2125  5K0  R-EU_R0805  [R0805]
R2126  5K0  R-EU_R0805  [R0805]
R2127  5K0  R-EU_R0805  [R0805]
R2128  5K0  R-EU_R0805  [R0805]
R2129  5K0  R-EU_R0805  [R0805]
R2130  5K0  R-EU_R0805  [R0805]
R2131  5K0  R-EU_R0805  [R0805]
R2132  5K0  R-EU_R0805  [R0805]
R2134  5K0  R-EU_R0805  [R0805]
R2135  5K0  R-EU_R0805  [R0805]
R2136  5K0  R-EU_R0805  [R0805]
R2137  5K0  R-EU_R0805  [R0805]
R2138  5K0  R-EU_R0805  [R0805]
R2140  5K0  R-EU_R0805  [R0805]
R2141  5K0  R-EU_R0805  [R0805]
R2142  5K0  R-EU_R0805  [R0805]
R2143  5K0  R-EU_R0805  [R0805]
R2144  5K0  R-EU_R0805  [R0805]
R2145  5K0  R-EU_R0805  [R0805]
R2146  5K0  R-EU_R0805  [R0805]
R2148  5K0  R-EU_R0805  [R0805]
R2149  5K0  R-EU_R0805  [R0805]
R2150  5K0  R-EU_R0805  [R0805]
R2151  5K0  R-EU_R0805  [R0805]
R2152  5K0  R-EU_R0805  [R0805]
R2154  5K0  R-EU_R0805  [R0805]
R2155  5K0  R-EU_R0805  [R0805]
R2156  5K0  R-EU_R0805  [R0805]
R2157  5K0  R-EU_R0805  [R0805]
R2158  5K0  R-EU_R0805  [R0805]
R2160  5K0  R-EU_R0805  [R0805]
R2161  5K0  R-EU_R0805  [R0805]
R2162  5K0  R-EU_R0805  [R0805]
R2163  5K0  R-EU_R0805  [R0805]
R2164  5K0  R-EU_R0805  [R0805]
R2165  5K0  R-EU_R0805  [R0805]
R2166  5K0  R-EU_R0805  [R0805]
R2167  5K0  R-EU_R0805  [R0805]
R2168  5K0  R-EU_R0805  [R0805]
R2169  5K0  R-EU_R0805  [R0805]
R2170  5K0  R-EU_R0805  [R0805]
R2171  5K0  R-EU_R0805  [R0805]
R2172  5K0  R-EU_R0805  [R0805]
R2173  5K0  R-EU_R0805  [R0805]
R2174  5K0  R-EU_R0805  [R0805]
R2175  5K0  R-EU_R0805  [R0805]
R2176  5K0  R-EU_R0805  [R0805]
T0001  BSS83N  [SOT143-R]
T0002  FDV301N  [SOT23-3]
T0003  FDV301N  [SOT23-3]
T0004  BSS83N  [SOT143-R]
T0005  BSS83N  [SOT143-R]
T0006  BSS83N  [SOT143-R]
T0007  BSS83N  [SOT143-R]
T0008  BSS83N  [SOT143-R]
T0009  BSS83N  [SOT143-R]
T0010  BSS83N  [SOT143-R]
T0011  BSS83N  [SOT143-R]
T0012  BSS83N  [SOT143-R]
T0013  BSS83N  [SOT143-R]
T0014  BSS83N  [SOT143-R]
T0015  BSS83N  [SOT143-R]
T0016  BSS83N  [SOT143-R]
T0017  BSS83N  [SOT143-R]
T0018  BSS83N  [SOT143-R]
T0019  BSS83N  [SOT143-R]
T0020  FDV301N  [SOT23-3]
T0021  BSS83N  [SOT143-R]
T0022  BSS83N  [SOT143-R]
T0023  BSS83N  [SOT143-R]
T0024  FDV301N  [SOT23-3]
T0025  FDV301N  [SOT23-3]
T0026  BSS83N  [SOT143-R]
T0027  BSS83N  [SOT143-R]
T0028  BSS83N  [SOT143-R]
T0029  FDV301N  [SOT23-3]
T0030  BSS83N  [SOT143-R]
T0031  BSS83N  [SOT143-R]
T0032  BSS83N  [SOT143-R]
T0033  FDV301N  [SOT23-3]
T0034  BSS83N  [SOT143-R]
T0035  BSS83N  [SOT143-R]
T0036  FDV301N  [SOT23-3]
T0037  BSS83N  [SOT143-R]
T0038  BSS83N  [SOT143-R]
T0039  FDV301N  [SOT23-3]
T0040  FDV301N  [SOT23-3]
T0041  BSS83N  [SOT143-R]
T0042  BSS83N  [SOT143-R]
T0043  FDV301N  [SOT23-3]
T0044  FDV301N  [SOT23-3]
T0045  BSS83N  [SOT143-R]
T0046  BSS83N  [SOT143-R]
T0047  BSS83N  [SOT143-R]
T0048  FDV301N  [SOT23-3]
T0049  FDV301N  [SOT23-3]
T0050  FDV301N  [SOT23-3]
T0051  FDV301N  [SOT23-3]
T0052  FDV301N  [SOT23-3]
T0053  BSS83N  [SOT143-R]
T0054  BSS83N  [SOT143-R]
T0055  BSS83N  [SOT143-R]
T0056  BSS83N  [SOT143-R]
T0057  FDV301N  [SOT23-3]
T0058  BSS83N  [SOT143-R]
T0059  FDV301N  [SOT23-3]
T0060  FDV301N  [SOT23-3]
T0061  FDV301N  [SOT23-3]
T0062  BSS83N  [SOT143-R]
T0063  BSS83N  [SOT143-R]
T0064  BSS83N  [SOT143-R]
T0065  BSS83N  [SOT143-R]
T0066  FDV301N  [SOT23-3]
T0067  FDV301N  [SOT23-3]
T0068  FDV301N  [SOT23-3]
T0069  BSS83N  [SOT143-R]
T0070  BSS83N  [SOT143-R]
T0071  FDV301N  [SOT23-3]
T0072  FDV301N  [SOT23-3]
T0073  BSS83N  [SOT143-R]
T0074  FDV301N  [SOT23-3]
T0075  BSS83N  [SOT143-R]
T0076  FDV301N  [SOT23-3]
T0077  FDV301N  [SOT23-3]
T0078  FDV301N  [SOT23-3]
T0079  FDV301N  [SOT23-3]
T0080  FDV301N  [SOT23-3]
T0081  FDV301N  [SOT23-3]
T0082  FDV301N  [SOT23-3]
T0083  FDV301N  [SOT23-3]
T0084  FDV301N  [SOT23-3]
T0085  FDV301N  [SOT23-3]
T0086  FDV301N  [SOT23-3]
T0087  FDV301N  [SOT23-3]
T0088  FDV301N  [SOT23-3]
T0089  FDV301N  [SOT23-3]
T0090  FDV301N  [SOT23-3]
T0091  FDV301N  [SOT23-3]
T0092  FDV301N  [SOT23-3]
T0093  FDV301N  [SOT23-3]
T0094  FDV301N  [SOT23-3]
T0095  FDV301N  [SOT23-3]
T0096  FDV301N  [SOT23-3]
T0097  FDV301N  [SOT23-3]
T0098  FDV301N  [SOT23-3]
T0099  FDV301N  [SOT23-3]
T0100  FDV301N  [SOT23-3]
T0101  FDV301N  [SOT23-3]
T0102  FDV301N  [SOT23-3]
T0103  FDV301N  [SOT23-3]
T0104  FDV301N  [SOT23-3]
T0105  FDV301N  [SOT23-3]
T0106  FDV301N  [SOT23-3]
T0107  FDV301N  [SOT23-3]
T0108  FDV301N  [SOT23-3]
T0109  BSS83N  [SOT143-R]
T0110  FDV301N  [SOT23-3]
T0111  FDV301N  [SOT23-3]
T0112  FDV301N  [SOT23-3]
T0113  FDV301N  [SOT23-3]
T0114  FDV301N  [SOT23-3]
T0115  FDV301N  [SOT23-3]
T0116  FDV301N  [SOT23-3]
T0117  BSS83N  [SOT143-R]
T0118  BSS83N  [SOT143-R]
T0119  FDV301N  [SOT23-3]
T0120  FDV301N  [SOT23-3]
T0121  FDV301N  [SOT23-3]
T0122  FDV301N  [SOT23-3]
T0123  FDV301N  [SOT23-3]
T0124  FDV301N  [SOT23-3]
T0125  FDV301N  [SOT23-3]
T0126  FDV301N  [SOT23-3]
T0127  FDV301N  [SOT23-3]
T0128  FDV301N  [SOT23-3]
T0129  FDV301N  [SOT23-3]
T0130  BSS83N  [SOT143-R]
T0131  FDV301N  [SOT23-3]
T0132  FDV301N  [SOT23-3]
T0133  FDV301N  [SOT23-3]
T0134  FDV301N  [SOT23-3]
T0135  FDV301N  [SOT23-3]
T0136  BSS83N  [SOT143-R]
T0137  BSS83N  [SOT143-R]
T0138  FDV301N  [SOT23-3]
T0139  FDV301N  [SOT23-3]
T0140  FDV301N  [SOT23-3]
T0141  FDV301N  [SOT23-3]
T0142  FDV301N  [SOT23-3]
T0143  FDV301N  [SOT23-3]
T0144  BSS83N  [SOT143-R]
T0145  FDV301N  [SOT23-3]
T0146  FDV301N  [SOT23-3]
T0147  BSS83N  [SOT143-R]
T0148  BSS83N  [SOT143-R]
T0149  BSS83N  [SOT143-R]
T0150  BSS83N  [SOT143-R]
T0151  BSS83N  [SOT143-R]
T0152  BSS83N  [SOT143-R]
T0153  BSS83N  [SOT143-R]
T0154  BSS83N  [SOT143-R]
T0155  BSS83N  [SOT143-R]
T0156  BSS83N  [SOT143-R]
T0157  BSS83N  [SOT143-R]
T0158  BSS83N  [SOT143-R]
T0159  FDV301N  [SOT23-3]
T0160  FDV301N  [SOT23-3]
T0161  FDV301N  [SOT23-3]
T0162  FDV301N  [SOT23-3]
T0163  FDV301N  [SOT23-3]
T0164  FDV301N  [SOT23-3]
T0165  FDV301N  [SOT23-3]
T0166  FDV301N  [SOT23-3]
T0167  FDV301N  [SOT23-3]
T0168  FDV301N  [SOT23-3]
T0169  FDV301N  [SOT23-3]
T0170  FDV301N  [SOT23-3]
T0171  BSS83N  [SOT143-R]
T0172  BSS83N  [SOT143-R]
T0173  BSS83N  [SOT143-R]
T0174  BSS83N  [SOT143-R]
T0175  FDV301N  [SOT23-3]
T0176  BSS83N  [SOT143-R]
T0177  BSS83N  [SOT143-R]
T0178  BSS83N  [SOT143-R]
T0179  FDV301N  [SOT23-3]
T0180  BSS83N  [SOT143-R]
T0181  BSS83N  [SOT143-R]
T0182  BSS83N  [SOT143-R]
T0183  BSS83N  [SOT143-R]
T0184  BSS83N  [SOT143-R]
T0185  BSS83N  [SOT143-R]
T0186  BSS83N  [SOT143-R]
T0187  BSS83N  [SOT143-R]
T0188  BSS83N  [SOT143-R]
T0189  BSS83N  [SOT143-R]
T0190  BSS83N  [SOT143-R]
T0191  BSS83N  [SOT143-R]
T0192  FDV301N  [SOT23-3]
T0193  BSS83N  [SOT143-R]
T0194  BSS83N  [SOT143-R]
T0195  BSS83N  [SOT143-R]
T0196  FDV301N  [SOT23-3]
T0197  BSS83N  [SOT143-R]
T0198  FDV301N  [SOT23-3]
T0199  FDV301N  [SOT23-3]
T0200  BSS83N  [SOT143-R]
T0201  BSS83N  [SOT143-R]
T0202  BSS83N  [SOT143-R]
T0203  BSS83N  [SOT143-R]
T0204  FDV301N  [SOT23-3]
T0205  FDV301N  [SOT23-3]
T0206  BSS83N  [SOT143-R]
T0207  BSS83N  [SOT143-R]
T0208  BSS83N  [SOT143-R]
T0209  FDV301N  [SOT23-3]
T0210  FDV301N  [SOT23-3]
T0211  BSS83N  [SOT143-R]
T0212  BSS83N  [SOT143-R]
T0213  BSS83N  [SOT143-R]
T0214  BSS83N  [SOT143-R]
T0215  BSS83N  [SOT143-R]
T0216  BSS83N  [SOT143-R]
T0217  BSS83N  [SOT143-R]
T0218  BSS83N  [SOT143-R]
T0219  BSS83N  [SOT143-R]
T0220  BSS83N  [SOT143-R]
T0221  BSS83N  [SOT143-R]
T0222  BSS83N  [SOT143-R]
T0223  BSS83N  [SOT143-R]
T0224  FDV301N  [SOT23-3]
T0225  FDV301N  [SOT23-3]
T0226  BSS83N  [SOT143-R]
T0227  FDV301N  [SOT23-3]
T0228  FDV301N  [SOT23-3]
T0229  BSS83N  [SOT143-R]
T0230  FDV301N  [SOT23-3]
T0231  BSS83N  [SOT143-R]
T0232  BSS83N  [SOT143-R]
T0233  FDV301N  [SOT23-3]
T0234  FDV301N  [SOT23-3]
T0235  BSS83N  [SOT143-R]
T0236  FDV301N  [SOT23-3]
T0237  BSS83N  [SOT143-R]
T0238  FDV301N  [SOT23-3]
T0239  FDV301N  [SOT23-3]
T0240  BSS83N  [SOT143-R]
T0241  BSS83N  [SOT143-R]
T0242  BSS83N  [SOT143-R]
T0243  BSS83N  [SOT143-R]
T0244  BSS83N  [SOT143-R]
T0245  BSS83N  [SOT143-R]
T0246  BSS83N  [SOT143-R]
T0247  BSS83N  [SOT143-R]
T0248  BSS83N  [SOT143-R]
T0249  BSS83N  [SOT143-R]
T0250  BSS83N  [SOT143-R]
T0251  BSS83N  [SOT143-R]
T0252  FDV301N  [SOT23-3]
T0253  BSS83N  [SOT143-R]
T0254  FDV301N  [SOT23-3]
T0255  FDV301N  [SOT23-3]
T0256  FDV301N  [SOT23-3]
T0257  FDV301N  [SOT23-3]
T0258  FDV301N  [SOT23-3]
T0259  BSS83N  [SOT143-R]
T0260  FDV301N  [SOT23-3]
T0261  FDV301N  [SOT23-3]
T0262  FDV301N  [SOT23-3]
T0263  FDV301N  [SOT23-3]
T0264  FDV301N  [SOT23-3]
T0265  BSS83N  [SOT143-R]
T0266  FDV301N  [SOT23-3]
T0267  FDV301N  [SOT23-3]
T0268  BSS83N  [SOT143-R]
T0269  FDV301N  [SOT23-3]
T0270  BSS83N  [SOT143-R]
T0271  FDV301N  [SOT23-3]
T0272  FDV301N  [SOT23-3]
T0273  FDV301N  [SOT23-3]
T0274  FDV301N  [SOT23-3]
T0275  FDV301N  [SOT23-3]
T0276  FDV301N  [SOT23-3]
T0277  FDV301N  [SOT23-3]
T0278  FDV301N  [SOT23-3]
T0279  FDV301N  [SOT23-3]
T0280  FDV301N  [SOT23-3]
T0281  FDV301N  [SOT23-3]
T0282  BSS83N  [SOT143-R]
T0283  FDV301N  [SOT23-3]
T0284  BSS83N  [SOT143-R]
T0285  FDV301N  [SOT23-3]
T0286  FDV301N  [SOT23-3]
T0287  FDV301N  [SOT23-3]
T0288  FDV301N  [SOT23-3]
T0289  FDV301N  [SOT23-3]
T0290  FDV301N  [SOT23-3]
T0291  BSS83N  [SOT143-R]
T0292  FDV301N  [SOT23-3]
T0293  BSS83N  [SOT143-R]
T0294  FDV301N  [SOT23-3]
T0295  FDV301N  [SOT23-3]
T0296  FDV301N  [SOT23-3]
T0297  BSS83N  [SOT143-R]
T0298  FDV301N  [SOT23-3]
T0299  FDV301N  [SOT23-3]
T0300  BSS83N  [SOT143-R]
T0301  BSS83N  [SOT143-R]
T0302  BSS83N  [SOT143-R]
T0303  BSS83N  [SOT143-R]
T0304  BSS83N  [SOT143-R]
T0305  FDV301N  [SOT23-3]
T0306  FDV301N  [SOT23-3]
T0307  FDV301N  [SOT23-3]
T0308  FDV301N  [SOT23-3]
T0309  FDV301N  [SOT23-3]
T0310  FDV301N  [SOT23-3]
T0311  FDV301N  [SOT23-3]
T0312  FDV301N  [SOT23-3]
T0313  FDV301N  [SOT23-3]
T0314  BSS83N  [SOT143-R]
T0315  BSS83N  [SOT143-R]
T0316  FDV301N  [SOT23-3]
T0317  FDV301N  [SOT23-3]
T0318  FDV301N  [SOT23-3]
T0319  BSS83N  [SOT143-R]
T0320  BSS83N  [SOT143-R]
T0321  FDV301N  [SOT23-3]
T0322  FDV301N  [SOT23-3]
T0323  FDV301N  [SOT23-3]
T0324  FDV301N  [SOT23-3]
T0325  FDV301N  [SOT23-3]
T0326  FDV301N  [SOT23-3]
T0327  BSS83N  [SOT143-R]
T0328  BSS83N  [SOT143-R]
T0329  FDV301N  [SOT23-3]
T0330  FDV301N  [SOT23-3]
T0331  BSS83N  [SOT143-R]
T0332  FDV301N  [SOT23-3]
T0333  FDV301N  [SOT23-3]
T0334  FDV301N  [SOT23-3]
T0335  FDV301N  [SOT23-3]
T0336  FDV301N  [SOT23-3]
T0337  FDV301N  [SOT23-3]
T0338  FDV301N  [SOT23-3]
T0339  FDV301N  [SOT23-3]
T0340  FDV301N  [SOT23-3]
T0341  BSS83N  [SOT143-R]
T0342  BSS83N  [SOT143-R]
T0343  FDV301N  [SOT23-3]
T0344  FDV301N  [SOT23-3]
T0345  BSS83N  [SOT143-R]
T0346  BSS83N  [SOT143-R]
T0347  FDV301N  [SOT23-3]
T0348  FDV301N  [SOT23-3]
T0349  BSS83N  [SOT143-R]
T0350  FDV301N  [SOT23-3]
T0351  FDV301N  [SOT23-3]
T0352  BSS83N  [SOT143-R]
T0353  BSS83N  [SOT143-R]
T0354  FDV301N  [SOT23-3]
T0355  FDV301N  [SOT23-3]
T0356  BSS83N  [SOT143-R]
T0357  BSS83N  [SOT143-R]
T0358  FDV301N  [SOT23-3]
T0359  BSS83N  [SOT143-R]
T0360  BSS83N  [SOT143-R]
T0361  BSS83N  [SOT143-R]
T0362  BSS83N  [SOT143-R]
T0363  FDV301N  [SOT23-3]
T0364  FDV301N  [SOT23-3]
T0365  FDV301N  [SOT23-3]
T0366  BSS83N  [SOT143-R]
T0367  FDV301N  [SOT23-3]
T0368  BSS83N  [SOT143-R]
T0369  FDV301N  [SOT23-3]
T0370  BSS83N  [SOT143-R]
T0371  BSS83N  [SOT143-R]
T0372  FDV301N  [SOT23-3]
T0373  FDV301N  [SOT23-3]
T0374  BSS83N  [SOT143-R]
T0375  BSS83N  [SOT143-R]
T0376  FDV301N  [SOT23-3]
T0377  BSS83N  [SOT143-R]
T0378  FDV301N  [SOT23-3]
T0379  FDV301N  [SOT23-3]
T0380  FDV301N  [SOT23-3]
T0381  FDV301N  [SOT23-3]
T0382  FDV301N  [SOT23-3]
T0383  FDV301N  [SOT23-3]
T0384  BSS83N  [SOT143-R]
T0385  FDV301N  [SOT23-3]
T0386  FDV301N  [SOT23-3]
T0387  FDV301N  [SOT23-3]
T0388  FDV301N  [SOT23-3]
T0389  BSS83N  [SOT143-R]
T0390  BSS83N  [SOT143-R]
T0391  FDV301N  [SOT23-3]
T0392  BSS83N  [SOT143-R]
T0393  FDV301N  [SOT23-3]
T0394  FDV301N  [SOT23-3]
T0395  FDV301N  [SOT23-3]
T0396  FDV301N  [SOT23-3]
T0397  FDV301N  [SOT23-3]
T0398  FDV301N  [SOT23-3]
T0399  FDV301N  [SOT23-3]
T0400  FDV301N  [SOT23-3]
T0401  FDV301N  [SOT23-3]
T0402  BSS83N  [SOT143-R]
T0403  FDV301N  [SOT23-3]
T0404  FDV301N  [SOT23-3]
T0405  FDV301N  [SOT23-3]
T0406  FDV301N  [SOT23-3]
T0407  FDV301N  [SOT23-3]
T0408  FDV301N  [SOT23-3]
T0409  FDV301N  [SOT23-3]
T0410  FDV301N  [SOT23-3]
T0411  FDV301N  [SOT23-3]
T0412  FDV301N  [SOT23-3]
T0413  FDV301N  [SOT23-3]
T0414  FDV301N  [SOT23-3]
T0415  FDV301N  [SOT23-3]
T0416  FDV301N  [SOT23-3]
T0417  BSS83N  [SOT143-R]
T0418  FDV301N  [SOT23-3]
T0419  BSS83N  [SOT143-R]
T0420  FDV301N  [SOT23-3]
T0421  FDV301N  [SOT23-3]
T0422  FDV301N  [SOT23-3]
T0423  BSS83N  [SOT143-R]
T0424  BSS83N  [SOT143-R]
T0425  FDV301N  [SOT23-3]
T0426  FDV301N  [SOT23-3]
T0427  FDV301N  [SOT23-3]
T0428  FDV301N  [SOT23-3]
T0429  FDV301N  [SOT23-3]
T0430  FDV301N  [SOT23-3]
T0431  FDV301N  [SOT23-3]
T0432  FDV301N  [SOT23-3]
T0433  FDV301N  [SOT23-3]
T0434  FDV301N  [SOT23-3]
T0435  FDV301N  [SOT23-3]
T0436  FDV301N  [SOT23-3]
T0437  FDV301N  [SOT23-3]
T0438  FDV301N  [SOT23-3]
T0439  BSS83N  [SOT143-R]
T0440  FDV301N  [SOT23-3]
T0441  FDV301N  [SOT23-3]
T0442  BSS83N  [SOT143-R]
T0443  BSS83N  [SOT143-R]
T0444  FDV301N  [SOT23-3]
T0445  FDV301N  [SOT23-3]
T0446  FDV301N  [SOT23-3]
T0447  BSS83N  [SOT143-R]
T0448  FDV301N  [SOT23-3]
T0449  FDV301N  [SOT23-3]
T0450  FDV301N  [SOT23-3]
T0451  FDV301N  [SOT23-3]
T0452  FDV301N  [SOT23-3]
T0453  FDV301N  [SOT23-3]
T0454  FDV301N  [SOT23-3]
T0455  FDV301N  [SOT23-3]
T0456  FDV301N  [SOT23-3]
T0457  BSS83N  [SOT143-R]
T0458  BSS83N  [SOT143-R]
T0459  FDV301N  [SOT23-3]
T0460  BSS83N  [SOT143-R]
T0461  FDV301N  [SOT23-3]
T0462  FDV301N  [SOT23-3]
T0463  FDV301N  [SOT23-3]
T0464  FDV301N  [SOT23-3]
T0465  FDV301N  [SOT23-3]
T0466  FDV301N  [SOT23-3]
T0467  FDV301N  [SOT23-3]
T0468  FDV301N  [SOT23-3]
T0469  FDV301N  [SOT23-3]
T0470  FDV301N  [SOT23-3]
T0471  FDV301N  [SOT23-3]
T0472  FDV301N  [SOT23-3]
T0473  BSS83N  [SOT143-R]
T0474  BSS83N  [SOT143-R]
T0475  BSS83N  [SOT143-R]
T0476  BSS83N  [SOT143-R]
T0477  BSS83N  [SOT143-R]
T0478  BSS83N  [SOT143-R]
T0479  BSS83N  [SOT143-R]
T0480  BSS83N  [SOT143-R]
T0481  BSS83N  [SOT143-R]
T0482  FDV301N  [SOT23-3]
T0483  FDV301N  [SOT23-3]
T0484  FDV301N  [SOT23-3]
T0485  FDV301N  [SOT23-3]
T0486  FDV301N  [SOT23-3]
T0487  FDV301N  [SOT23-3]
T0488  FDV301N  [SOT23-3]
T0489  FDV301N  [SOT23-3]
T0490  FDV301N  [SOT23-3]
T0491  FDV301N  [SOT23-3]
T0492  FDV301N  [SOT23-3]
T0493  FDV301N  [SOT23-3]
T0494  FDV301N  [SOT23-3]
T0495  FDV301N  [SOT23-3]
T0496  FDV301N  [SOT23-3]
T0497  FDV301N  [SOT23-3]
T0498  BSS83N  [SOT143-R]
T0499  BSS83N  [SOT143-R]
T0500  FDV301N  [SOT23-3]
T0501  FDV301N  [SOT23-3]
T0502  FDV301N  [SOT23-3]
T0503  FDV301N  [SOT23-3]
T0504  FDV301N  [SOT23-3]
T0505  FDV301N  [SOT23-3]
T0506  FDV301N  [SOT23-3]
T0507  BSS83N  [SOT143-R]
T0508  BSS83N  [SOT143-R]
T0509  BSS83N  [SOT143-R]
T0510  BSS83N  [SOT143-R]
T0511  BSS83N  [SOT143-R]
T0512  BSS83N  [SOT143-R]
T0513  BSS83N  [SOT143-R]
T0514  BSS83N  [SOT143-R]
T0515  FDV301N  [SOT23-3]
T0516  FDV301N  [SOT23-3]
T0517  FDV301N  [SOT23-3]
T0518  FDV301N  [SOT23-3]
T0519  FDV301N  [SOT23-3]
T0520  BSS83N  [SOT143-R]
T0521  BSS83N  [SOT143-R]
T0522  BSS83N  [SOT143-R]
T0523  BSS83N  [SOT143-R]
T0524  FDV301N  [SOT23-3]
T0525  FDV301N  [SOT23-3]
T0526  FDV301N  [SOT23-3]
T0527  FDV301N  [SOT23-3]
T0528  BSS83N  [SOT143-R]
T0529  FDV301N  [SOT23-3]
T0530  FDV301N  [SOT23-3]
T0531  FDV301N  [SOT23-3]
T0532  BSS83N  [SOT143-R]
T0533  BSS83N  [SOT143-R]
T0534  BSS83N  [SOT143-R]
T0535  FDV301N  [SOT23-3]
T0536  BSS83N  [SOT143-R]
T0537  BSS83N  [SOT143-R]
T0538  FDV301N  [SOT23-3]
T0539  FDV301N  [SOT23-3]
T0540  FDV301N  [SOT23-3]
T0541  FDV301N  [SOT23-3]
T0542  FDV301N  [SOT23-3]
T0543  FDV301N  [SOT23-3]
T0544  BSS83N  [SOT143-R]
T0545  FDV301N  [SOT23-3]
T0546  BSS83N  [SOT143-R]
T0547  BSS83N  [SOT143-R]
T0548  BSS83N  [SOT143-R]
T0549  BSS83N  [SOT143-R]
T0550  BSS83N  [SOT143-R]
T0551  BSS83N  [SOT143-R]
T0552  BSS83N  [SOT143-R]
T0553  BSS83N  [SOT143-R]
T0554  FDV301N  [SOT23-3]
T0555  FDV301N  [SOT23-3]
T0556  FDV301N  [SOT23-3]
T0557  FDV301N  [SOT23-3]
T0558  FDV301N  [SOT23-3]
T0559  FDV301N  [SOT23-3]
T0560  FDV301N  [SOT23-3]
T0561  FDV301N  [SOT23-3]
T0562  BSS83N  [SOT143-R]
T0563  FDV301N  [SOT23-3]
T0564  FDV301N  [SOT23-3]
T0565  FDV301N  [SOT23-3]
T0566  FDV301N  [SOT23-3]
T0567  FDV301N  [SOT23-3]
T0568  BSS83N  [SOT143-R]
T0569  FDV301N  [SOT23-3]
T0570  FDV301N  [SOT23-3]
T0571  FDV301N  [SOT23-3]
T0572  FDV301N  [SOT23-3]
T0573  FDV301N  [SOT23-3]
T0574  FDV301N  [SOT23-3]
T0575  BSS83N  [SOT143-R]
T0576  FDV301N  [SOT23-3]
T0577  BSS83N  [SOT143-R]
T0578  BSS83N  [SOT143-R]
T0579  FDV301N  [SOT23-3]
T0580  BSS83N  [SOT143-R]
T0581  FDV301N  [SOT23-3]
T0582  FDV301N  [SOT23-3]
T0583  FDV301N  [SOT23-3]
T0584  FDV301N  [SOT23-3]
T0585  FDV301N  [SOT23-3]
T0586  FDV301N  [SOT23-3]
T0587  FDV301N  [SOT23-3]
T0588  FDV301N  [SOT23-3]
T0589  FDV301N  [SOT23-3]
T0590  FDV301N  [SOT23-3]
T0591  FDV301N  [SOT23-3]
T0592  FDV301N  [SOT23-3]
T0593  FDV301N  [SOT23-3]
T0594  BSS83N  [SOT143-R]
T0595  BSS83N  [SOT143-R]
T0596  BSS83N  [SOT143-R]
T0597  BSS83N  [SOT143-R]
T0598  BSS83N  [SOT143-R]
T0599  BSS83N  [SOT143-R]
T0600  BSS83N  [SOT143-R]
T0601  BSS83N  [SOT143-R]
T0602  BSS83N  [SOT143-R]
T0603  FDV301N  [SOT23-3]
T0604  FDV301N  [SOT23-3]
T0605  FDV301N  [SOT23-3]
T0606  FDV301N  [SOT23-3]
T0607  FDV301N  [SOT23-3]
T0608  FDV301N  [SOT23-3]
T0609  FDV301N  [SOT23-3]
T0610  FDV301N  [SOT23-3]
T0611  FDV301N  [SOT23-3]
T0612  FDV301N  [SOT23-3]
T0613  FDV301N  [SOT23-3]
T0614  FDV301N  [SOT23-3]
T0615  FDV301N  [SOT23-3]
T0616  BSS83N  [SOT143-R]
T0617  FDV301N  [SOT23-3]
T0618  FDV301N  [SOT23-3]
T0619  FDV301N  [SOT23-3]
T0620  FDV301N  [SOT23-3]
T0621  BSS83N  [SOT143-R]
T0622  FDV301N  [SOT23-3]
T0623  FDV301N  [SOT23-3]
T0624  BSS83N  [SOT143-R]
T0625  BSS83N  [SOT143-R]
T0626  BSS83N  [SOT143-R]
T0627  FDV301N  [SOT23-3]
T0628  FDV301N  [SOT23-3]
T0629  FDV301N  [SOT23-3]
T0630  FDV301N  [SOT23-3]
T0631  FDV301N  [SOT23-3]
T0632  BSS83N  [SOT143-R]
T0633  FDV301N  [SOT23-3]
T0634  FDV301N  [SOT23-3]
T0635  FDV301N  [SOT23-3]
T0636  BSS83N  [SOT143-R]
T0637  FDV301N  [SOT23-3]
T0638  BSS83N  [SOT143-R]
T0639  BSS83N  [SOT143-R]
T0640  BSS83N  [SOT143-R]
T0641  FDV301N  [SOT23-3]
T0642  BSS83N  [SOT143-R]
T0643  BSS83N  [SOT143-R]
T0644  FDV301N  [SOT23-3]
T0645  BSS83N  [SOT143-R]
T0646  FDV301N  [SOT23-3]
T0647  FDV301N  [SOT23-3]
T0648  FDV301N  [SOT23-3]
T0649  FDV301N  [SOT23-3]
T0650  FDV301N  [SOT23-3]
T0651  FDV301N  [SOT23-3]
T0652  FDV301N  [SOT23-3]
T0653  FDV301N  [SOT23-3]
T0654  FDV301N  [SOT23-3]
T0655  BSS83N  [SOT143-R]
T0656  FDV301N  [SOT23-3]
T0657  BSS83N  [SOT143-R]
T0658  BSS83N  [SOT143-R]
T0659  BSS83N  [SOT143-R]
T0660  BSS83N  [SOT143-R]
T0661  BSS83N  [SOT143-R]
T0662  BSS83N  [SOT143-R]
T0663  BSS83N  [SOT143-R]
T0664  BSS83N  [SOT143-R]
T0665  FDV301N  [SOT23-3]
T0666  FDV301N  [SOT23-3]
T0667  BSS83N  [SOT143-R]
T0668  BSS83N  [SOT143-R]
T0669  BSS83N  [SOT143-R]
T0670  BSS83N  [SOT143-R]
T0671  BSS83N  [SOT143-R]
T0672  FDV301N  [SOT23-3]
T0673  FDV301N  [SOT23-3]
T0674  FDV301N  [SOT23-3]
T0675  FDV301N  [SOT23-3]
T0676  FDV301N  [SOT23-3]
T0677  FDV301N  [SOT23-3]
T0678  FDV301N  [SOT23-3]
T0679  FDV301N  [SOT23-3]
T0680  FDV301N  [SOT23-3]
T0681  FDV301N  [SOT23-3]
T0682  FDV301N  [SOT23-3]
T0683  FDV301N  [SOT23-3]
T0684  BSS83N  [SOT143-R]
T0685  BSS83N  [SOT143-R]
T0686  FDV301N  [SOT23-3]
T0687  FDV301N  [SOT23-3]
T0688  FDV301N  [SOT23-3]
T0689  FDV301N  [SOT23-3]
T0690  FDV301N  [SOT23-3]
T0691  BSS83N  [SOT143-R]
T0692  FDV301N  [SOT23-3]
T0693  FDV301N  [SOT23-3]
T0694  BSS83N  [SOT143-R]
T0695  FDV301N  [SOT23-3]
T0696  FDV301N  [SOT23-3]
T0697  FDV301N  [SOT23-3]
T0698  FDV301N  [SOT23-3]
T0699  FDV301N  [SOT23-3]
T0700  FDV301N  [SOT23-3]
T0701  BSS83N  [SOT143-R]
T0702  BSS83N  [SOT143-R]
T0703  FDV301N  [SOT23-3]
T0704  BSS83N  [SOT143-R]
T0705  FDV301N  [SOT23-3]
T0706  FDV301N  [SOT23-3]
T0707  FDV301N  [SOT23-3]
T0708  FDV301N  [SOT23-3]
T0709  FDV301N  [SOT23-3]
T0710  FDV301N  [SOT23-3]
T0711  FDV301N  [SOT23-3]
T0712  FDV301N  [SOT23-3]
T0713  FDV301N  [SOT23-3]
T0714  BSS83N  [SOT143-R]
T0715  FDV301N  [SOT23-3]
T0716  BSS83N  [SOT143-R]
T0717  BSS83N  [SOT143-R]
T0718  FDV301N  [SOT23-3]
T0719  BSS83N  [SOT143-R]
T0720  BSS83N  [SOT143-R]
T0721  BSS83N  [SOT143-R]
T0722  BSS83N  [SOT143-R]
T0723  BSS83N  [SOT143-R]
T0724  BSS83N  [SOT143-R]
T0725  BSS83N  [SOT143-R]
T0726  BSS83N  [SOT143-R]
T0727  BSS83N  [SOT143-R]
T0728  FDV301N  [SOT23-3]
T0729  FDV301N  [SOT23-3]
T0730  BSS83N  [SOT143-R]
T0731  FDV301N  [SOT23-3]
T0732  FDV301N  [SOT23-3]
T0733  FDV301N  [SOT23-3]
T0734  FDV301N  [SOT23-3]
T0735  FDV301N  [SOT23-3]
T0736  FDV301N  [SOT23-3]
T0737  FDV301N  [SOT23-3]
T0738  FDV301N  [SOT23-3]
T0739  FDV301N  [SOT23-3]
T0740  FDV301N  [SOT23-3]
T0741  FDV301N  [SOT23-3]
T0742  BSS83N  [SOT143-R]
T0743  FDV301N  [SOT23-3]
T0744  FDV301N  [SOT23-3]
T0745  FDV301N  [SOT23-3]
T0746  FDV301N  [SOT23-3]
T0747  FDV301N  [SOT23-3]
T0748  FDV301N  [SOT23-3]
T0749  BSS83N  [SOT143-R]
T0750  BSS83N  [SOT143-R]
T0751  FDV301N  [SOT23-3]
T0752  BSS83N  [SOT143-R]
T0753  BSS83N  [SOT143-R]
T0754  BSS83N  [SOT143-R]
T0755  FDV301N  [SOT23-3]
T0756  FDV301N  [SOT23-3]
T0757  FDV301N  [SOT23-3]
T0758  FDV301N  [SOT23-3]
T0759  FDV301N  [SOT23-3]
T0760  FDV301N  [SOT23-3]
T0761  FDV301N  [SOT23-3]
T0762  FDV301N  [SOT23-3]
T0763  FDV301N  [SOT23-3]
T0764  BSS83N  [SOT143-R]
T0765  FDV301N  [SOT23-3]
T0766  BSS83N  [SOT143-R]
T0767  BSS83N  [SOT143-R]
T0768  FDV301N  [SOT23-3]
T0769  FDV301N  [SOT23-3]
T0770  FDV301N  [SOT23-3]
T0771  FDV301N  [SOT23-3]
T0772  FDV301N  [SOT23-3]
T0773  FDV301N  [SOT23-3]
T0774  FDV301N  [SOT23-3]
T0775  BSS83N  [SOT143-R]
T0776  FDV301N  [SOT23-3]
T0777  BSS83N  [SOT143-R]
T0778  BSS83N  [SOT143-R]
T0779  BSS83N  [SOT143-R]
T0780  BSS83N  [SOT143-R]
T0781  BSS83N  [SOT143-R]
T0782  BSS83N  [SOT143-R]
T0783  BSS83N  [SOT143-R]
T0784  BSS83N  [SOT143-R]
T0785  BSS83N  [SOT143-R]
T0786  BSS83N  [SOT143-R]
T0787  FDV301N  [SOT23-3]
T0788  FDV301N  [SOT23-3]
T0789  FDV301N  [SOT23-3]
T0790  FDV301N  [SOT23-3]
T0791  FDV301N  [SOT23-3]
T0792  FDV301N  [SOT23-3]
T0793  FDV301N  [SOT23-3]
T0794  FDV301N  [SOT23-3]
T0795  FDV301N  [SOT23-3]
T0796  FDV301N  [SOT23-3]
T0797  FDV301N  [SOT23-3]
T0798  FDV301N  [SOT23-3]
T0799  FDV301N  [SOT23-3]
T0800  BSS83N  [SOT143-R]
T0801  FDV301N  [SOT23-3]
T0802  FDV301N  [SOT23-3]
T0803  FDV301N  [SOT23-3]
T0804  FDV301N  [SOT23-3]
T0805  FDV301N  [SOT23-3]
T0806  FDV301N  [SOT23-3]
T0807  FDV301N  [SOT23-3]
T0808  FDV301N  [SOT23-3]
T0809  FDV301N  [SOT23-3]
T0810  BSS83N  [SOT143-R]
T0811  BSS83N  [SOT143-R]
T0812  FDV301N  [SOT23-3]
T0813  FDV301N  [SOT23-3]
T0814  BSS83N  [SOT143-R]
T0815  FDV301N  [SOT23-3]
T0816  FDV301N  [SOT23-3]
T0817  FDV301N  [SOT23-3]
T0818  FDV301N  [SOT23-3]
T0819  FDV301N  [SOT23-3]
T0820  FDV301N  [SOT23-3]
T0821  FDV301N  [SOT23-3]
T0822  FDV301N  [SOT23-3]
T0823  FDV301N  [SOT23-3]
T0824  BSS83N  [SOT143-R]
T0825  BSS83N  [SOT143-R]
T0826  FDV301N  [SOT23-3]
T0827  BSS83N  [SOT143-R]
T0828  BSS83N  [SOT143-R]
T0829  BSS83N  [SOT143-R]
T0830  BSS83N  [SOT143-R]
T0831  BSS83N  [SOT143-R]
T0832  BSS83N  [SOT143-R]
T0833  BSS83N  [SOT143-R]
T0834  BSS83N  [SOT143-R]
T0835  BSS83N  [SOT143-R]
T0836  FDV301N  [SOT23-3]
T0837  FDV301N  [SOT23-3]
T0838  FDV301N  [SOT23-3]
T0839  FDV301N  [SOT23-3]
T0840  FDV301N  [SOT23-3]
T0841  FDV301N  [SOT23-3]
T0842  FDV301N  [SOT23-3]
T0843  BSS83N  [SOT143-R]
T0844  FDV301N  [SOT23-3]
T0845  FDV301N  [SOT23-3]
T0846  FDV301N  [SOT23-3]
T0847  FDV301N  [SOT23-3]
T0848  FDV301N  [SOT23-3]
T0849  BSS83N  [SOT143-R]
T0850  BSS83N  [SOT143-R]
T0851  FDV301N  [SOT23-3]
T0852  FDV301N  [SOT23-3]
T0853  FDV301N  [SOT23-3]
T0854  FDV301N  [SOT23-3]
T0855  BSS83N  [SOT143-R]
T0856  FDV301N  [SOT23-3]
T0857  BSS83N  [SOT143-R]
T0858  BSS83N  [SOT143-R]
T0859  BSS83N  [SOT143-R]
T0860  BSS83N  [SOT143-R]
T0861  FDV301N  [SOT23-3]
T0862  BSS83N  [SOT143-R]
T0863  BSS83N  [SOT143-R]
T0864  FDV301N  [SOT23-3]
T0865  FDV301N  [SOT23-3]
T0866  BSS83N  [SOT143-R]
T0867  FDV301N  [SOT23-3]
T0868  BSS83N  [SOT143-R]
T0869  FDV301N  [SOT23-3]
T0870  BSS83N  [SOT143-R]
T0871  FDV301N  [SOT23-3]
T0872  BSS83N  [SOT143-R]
T0873  FDV301N  [SOT23-3]
T0874  FDV301N  [SOT23-3]
T0875  FDV301N  [SOT23-3]
T0876  FDV301N  [SOT23-3]
T0877  FDV301N  [SOT23-3]
T0878  FDV301N  [SOT23-3]
T0879  FDV301N  [SOT23-3]
T0880  BSS83N  [SOT143-R]
T0881  FDV301N  [SOT23-3]
T0882  FDV301N  [SOT23-3]
T0883  FDV301N  [SOT23-3]
T0884  FDV301N  [SOT23-3]
T0885  FDV301N  [SOT23-3]
T0886  FDV301N  [SOT23-3]
T0887  FDV301N  [SOT23-3]
T0888  FDV301N  [SOT23-3]
T0889  FDV301N  [SOT23-3]
T0890  BSS83N  [SOT143-R]
T0891  BSS83N  [SOT143-R]
T0892  FDV301N  [SOT23-3]
T0893  BSS83N  [SOT143-R]
T0894  FDV301N  [SOT23-3]
T0895  FDV301N  [SOT23-3]
T0896  FDV301N  [SOT23-3]
T0897  BSS83N  [SOT143-R]
T0898  FDV301N  [SOT23-3]
T0899  FDV301N  [SOT23-3]
T0900  FDV301N  [SOT23-3]
T0901  BSS83N  [SOT143-R]
T0902  FDV301N  [SOT23-3]
T0903  FDV301N  [SOT23-3]
T0904  FDV301N  [SOT23-3]
T0905  FDV301N  [SOT23-3]
T0906  FDV301N  [SOT23-3]
T0907  FDV301N  [SOT23-3]
T0908  FDV301N  [SOT23-3]
T0909  FDV301N  [SOT23-3]
T0910  FDV301N  [SOT23-3]
T0911  FDV301N  [SOT23-3]
T0912  FDV301N  [SOT23-3]
T0913  FDV301N  [SOT23-3]
T0914  FDV301N  [SOT23-3]
T0915  FDV301N  [SOT23-3]
T0916  FDV301N  [SOT23-3]
T0917  FDV301N  [SOT23-3]
T0918  FDV301N  [SOT23-3]
T0919  FDV301N  [SOT23-3]
T0920  FDV301N  [SOT23-3]
T0921  FDV301N  [SOT23-3]
T0922  FDV301N  [SOT23-3]
T0923  FDV301N  [SOT23-3]
T0924  FDV301N  [SOT23-3]
T0925  FDV301N  [SOT23-3]
T0926  FDV301N  [SOT23-3]
T0927  FDV301N  [SOT23-3]
T0928  FDV301N  [SOT23-3]
T0929  FDV301N  [SOT23-3]
T0930  FDV301N  [SOT23-3]
T0931  FDV301N  [SOT23-3]
T0932  BSS83N  [SOT143-R]
T0933  FDV301N  [SOT23-3]
T0934  FDV301N  [SOT23-3]
T0935  FDV301N  [SOT23-3]
T0936  FDV301N  [SOT23-3]
T0937  BSS83N  [SOT143-R]
T0938  FDV301N  [SOT23-3]
T0939  BSS83N  [SOT143-R]
T0940  FDV301N  [SOT23-3]
T0941  BSS83N  [SOT143-R]
T0942  FDV301N  [SOT23-3]
T0943  BSS83N  [SOT143-R]
T0944  FDV301N  [SOT23-3]
T0945  BSS83N  [SOT143-R]
T0946  FDV301N  [SOT23-3]
T0947  FDV301N  [SOT23-3]
T0948  FDV301N  [SOT23-3]
T0949  FDV301N  [SOT23-3]
T0950  FDV301N  [SOT23-3]
T0951  FDV301N  [SOT23-3]
T0952  FDV301N  [SOT23-3]
T0953  BSS83N  [SOT143-R]
T0954  BSS83N  [SOT143-R]
T0955  FDV301N  [SOT23-3]
T0956  FDV301N  [SOT23-3]
T0957  FDV301N  [SOT23-3]
T0958  FDV301N  [SOT23-3]
T0959  FDV301N  [SOT23-3]
T0960  BSS83N  [SOT143-R]
T0961  BSS83N  [SOT143-R]
T0962  FDV301N  [SOT23-3]
T0963  FDV301N  [SOT23-3]
T0964  FDV301N  [SOT23-3]
T0965  FDV301N  [SOT23-3]
T0966  FDV301N  [SOT23-3]
T0967  FDV301N  [SOT23-3]
T0968  FDV301N  [SOT23-3]
T0969  FDV301N  [SOT23-3]
T0970  FDV301N  [SOT23-3]
T0971  FDV301N  [SOT23-3]
T0972  FDV301N  [SOT23-3]
T0973  FDV301N  [SOT23-3]
T0974  BSS83N  [SOT143-R]
T0975  BSS83N  [SOT143-R]
T0976  BSS83N  [SOT143-R]
T0977  BSS83N  [SOT143-R]
T0978  BSS83N  [SOT143-R]
T0979  FDV301N  [SOT23-3]
T0980  FDV301N  [SOT23-3]
T0981  BSS83N  [SOT143-R]
T0982  FDV301N  [SOT23-3]
T0983  BSS83N  [SOT143-R]
T0984  FDV301N  [SOT23-3]
T0985  BSS83N  [SOT143-R]
T0986  FDV301N  [SOT23-3]
T0987  BSS83N  [SOT143-R]
T0988  FDV301N  [SOT23-3]
T0989  BSS83N  [SOT143-R]
T0990  FDV301N  [SOT23-3]
T0991  BSS83N  [SOT143-R]
T0992  FDV301N  [SOT23-3]
T0993  BSS83N  [SOT143-R]
T0994  FDV301N  [SOT23-3]
T0995  FDV301N  [SOT23-3]
T0996  BSS83N  [SOT143-R]
T0997  FDV301N  [SOT23-3]
T0998  FDV301N  [SOT23-3]
T0999  FDV301N  [SOT23-3]
T1000  FDV301N  [SOT23-3]
T1001  FDV301N  [SOT23-3]
T1002  FDV301N  [SOT23-3]
T1003  FDV301N  [SOT23-3]
T1004  FDV301N  [SOT23-3]
T1005  FDV301N  [SOT23-3]
T1006  FDV301N  [SOT23-3]
T1007  FDV301N  [SOT23-3]
T1008  BSS83N  [SOT143-R]
T1009  BSS83N  [SOT143-R]
T1010  FDV301N  [SOT23-3]
T1011  FDV301N  [SOT23-3]
T1012  FDV301N  [SOT23-3]
T1013  FDV301N  [SOT23-3]
T1014  FDV301N  [SOT23-3]
T1015  FDV301N  [SOT23-3]
T1016  FDV301N  [SOT23-3]
T1017  FDV301N  [SOT23-3]
T1018  FDV301N  [SOT23-3]
T1019  FDV301N  [SOT23-3]
T1020  BSS83N  [SOT143-R]
T1021  BSS83N  [SOT143-R]
T1022  BSS83N  [SOT143-R]
T1023  BSS83N  [SOT143-R]
T1024  BSS83N  [SOT143-R]
T1025  BSS83N  [SOT143-R]
T1026  BSS83N  [SOT143-R]
T1027  BSS83N  [SOT143-R]
T1028  FDV301N  [SOT23-3]
T1029  FDV301N  [SOT23-3]
T1030  FDV301N  [SOT23-3]
T1031  FDV301N  [SOT23-3]
T1032  FDV301N  [SOT23-3]
T1033  FDV301N  [SOT23-3]
T1034  FDV301N  [SOT23-3]
T1035  FDV301N  [SOT23-3]
T1036  FDV301N  [SOT23-3]
T1037  FDV301N  [SOT23-3]
T1038  FDV301N  [SOT23-3]
T1039  FDV301N  [SOT23-3]
T1040  FDV301N  [SOT23-3]
T1041  FDV301N  [SOT23-3]
T1042  FDV301N  [SOT23-3]
T1043  FDV301N  [SOT23-3]
T1044  FDV301N  [SOT23-3]
T1045  FDV301N  [SOT23-3]
T1046  FDV301N  [SOT23-3]
T1047  FDV301N  [SOT23-3]
T1048  FDV301N  [SOT23-3]
T1049  FDV301N  [SOT23-3]
T1050  FDV301N  [SOT23-3]
T1051  FDV301N  [SOT23-3]
T1052  FDV301N  [SOT23-3]
T1053  FDV301N  [SOT23-3]
T1054  FDV301N  [SOT23-3]
T1055  FDV301N  [SOT23-3]
T1056  FDV301N  [SOT23-3]
T1057  FDV301N  [SOT23-3]
T1058  FDV301N  [SOT23-3]
T1059  FDV301N  [SOT23-3]
T1060  BSS83N  [SOT143-R]
T1061  FDV301N  [SOT23-3]
T1062  FDV301N  [SOT23-3]
T1063  FDV301N  [SOT23-3]
T1064  FDV301N  [SOT23-3]
T1065  FDV301N  [SOT23-3]
T1066  FDV301N  [SOT23-3]
T1067  FDV301N  [SOT23-3]
T1068  FDV301N  [SOT23-3]
T1069  FDV301N  [SOT23-3]
T1070  FDV301N  [SOT23-3]
T1071  FDV301N  [SOT23-3]
T1072  FDV301N  [SOT23-3]
T1073  FDV301N  [SOT23-3]
T1074  FDV301N  [SOT23-3]
T1075  FDV301N  [SOT23-3]
T1076  FDV301N  [SOT23-3]
T1077  BSS83N  [SOT143-R]
T1078  BSS83N  [SOT143-R]
T1079  BSS83N  [SOT143-R]
T1080  BSS83N  [SOT143-R]
T1081  BSS83N  [SOT143-R]
T1082  BSS83N  [SOT143-R]
T1083  BSS83N  [SOT143-R]
T1084  BSS83N  [SOT143-R]
T1085  BSS83N  [SOT143-R]
T1086  BSS83N  [SOT143-R]
T1087  BSS83N  [SOT143-R]
T1088  BSS83N  [SOT143-R]
T1089  FDV301N  [SOT23-3]
T1090  FDV301N  [SOT23-3]
T1091  FDV301N  [SOT23-3]
T1092  FDV301N  [SOT23-3]
T1093  FDV301N  [SOT23-3]
T1094  FDV301N  [SOT23-3]
T1095  FDV301N  [SOT23-3]
T1096  FDV301N  [SOT23-3]
T1097  FDV301N  [SOT23-3]
T1098  FDV301N  [SOT23-3]
T1099  FDV301N  [SOT23-3]
T1100  FDV301N  [SOT23-3]
T1101  FDV301N  [SOT23-3]
T1102  BSS83N  [SOT143-R]
T1103  BSS83N  [SOT143-R]
T1104  BSS83N  [SOT143-R]
T1105  FDV301N  [SOT23-3]
T1106  BSS83N  [SOT143-R]
T1107  BSS83N  [SOT143-R]
T1108  BSS83N  [SOT143-R]
T1109  BSS83N  [SOT143-R]
T1110  BSS83N  [SOT143-R]
T1111  BSS83N  [SOT143-R]
T1112  BSS83N  [SOT143-R]
T1113  BSS83N  [SOT143-R]
T1114  BSS83N  [SOT143-R]
T1115  BSS83N  [SOT143-R]
T1116  BSS83N  [SOT143-R]
T1117  BSS83N  [SOT143-R]
T1118  BSS83N  [SOT143-R]
T1119  BSS83N  [SOT143-R]
T1120  BSS83N  [SOT143-R]
T1121  BSS83N  [SOT143-R]
T1122  BSS83N  [SOT143-R]
T1123  BSS83N  [SOT143-R]
T1124  BSS83N  [SOT143-R]
T1125  BSS83N  [SOT143-R]
T1126  BSS83N  [SOT143-R]
T1127  BSS83N  [SOT143-R]
T1128  BSS83N  [SOT143-R]
T1129  BSS83N  [SOT143-R]
T1130  BSS83N  [SOT143-R]
T1131  BSS83N  [SOT143-R]
T1132  BSS83N  [SOT143-R]
T1133  BSS83N  [SOT143-R]
T1134  FDV301N  [SOT23-3]
T1135  FDV301N  [SOT23-3]
T1136  FDV301N  [SOT23-3]
T1137  FDV301N  [SOT23-3]
T1138  FDV301N  [SOT23-3]
T1139  FDV301N  [SOT23-3]
T1140  FDV301N  [SOT23-3]
T1141  FDV301N  [SOT23-3]
T1142  FDV301N  [SOT23-3]
T1143  FDV301N  [SOT23-3]
T1144  FDV301N  [SOT23-3]
T1145  FDV301N  [SOT23-3]
T1146  BSS83N  [SOT143-R]
T1147  BSS83N  [SOT143-R]
T1148  FDV301N  [SOT23-3]
T1149  BSS83N  [SOT143-R]
T1150  FDV301N  [SOT23-3]
T1151  FDV301N  [SOT23-3]
T1152  FDV301N  [SOT23-3]
T1153  FDV301N  [SOT23-3]
T1154  FDV301N  [SOT23-3]
T1155  FDV301N  [SOT23-3]
T1156  FDV301N  [SOT23-3]
T1157  FDV301N  [SOT23-3]
T1158  FDV301N  [SOT23-3]
T1159  FDV301N  [SOT23-3]
T1160  FDV301N  [SOT23-3]
T1161  FDV301N  [SOT23-3]
T1162  FDV301N  [SOT23-3]
T1163  FDV301N  [SOT23-3]
T1164  FDV301N  [SOT23-3]
T1165  FDV301N  [SOT23-3]
T1166  FDV301N  [SOT23-3]
T1167  FDV301N  [SOT23-3]
T1168  FDV301N  [SOT23-3]
T1169  BSS83N  [SOT143-R]
T1170  BSS83N  [SOT143-R]
T1171  BSS83N  [SOT143-R]
T1172  BSS83N  [SOT143-R]
T1173  BSS83N  [SOT143-R]
T1174  BSS83N  [SOT143-R]
T1175  BSS83N  [SOT143-R]
T1176  BSS83N  [SOT143-R]
T1177  BSS83N  [SOT143-R]
T1178  BSS83N  [SOT143-R]
T1179  BSS83N  [SOT143-R]
T1180  BSS83N  [SOT143-R]
T1181  BSS83N  [SOT143-R]
T1182  FDV301N  [SOT23-3]
T1183  FDV301N  [SOT23-3]
T1184  BSS83N  [SOT143-R]
T1185  BSS83N  [SOT143-R]
T1186  FDV301N  [SOT23-3]
T1187  FDV301N  [SOT23-3]
T1188  FDV301N  [SOT23-3]
T1189  FDV301N  [SOT23-3]
T1190  FDV301N  [SOT23-3]
T1191  FDV301N  [SOT23-3]
T1192  BSS83N  [SOT143-R]
T1193  BSS83N  [SOT143-R]
T1194  FDV301N  [SOT23-3]
T1195  FDV301N  [SOT23-3]
T1196  FDV301N  [SOT23-3]
T1197  FDV301N  [SOT23-3]
T1198  FDV301N  [SOT23-3]
T1199  FDV301N  [SOT23-3]
T1200  FDV301N  [SOT23-3]
T1201  FDV301N  [SOT23-3]
T1202  FDV301N  [SOT23-3]
T1203  FDV301N  [SOT23-3]
T1204  FDV301N  [SOT23-3]
T1205  FDV301N  [SOT23-3]
T1206  FDV301N  [SOT23-3]
T1207  FDV301N  [SOT23-3]
T1208  FDV301N  [SOT23-3]
T1209  FDV301N  [SOT23-3]
T1210  FDV301N  [SOT23-3]
T1211  BSS83N  [SOT143-R]
T1212  BSS83N  [SOT143-R]
T1213  BSS83N  [SOT143-R]
T1214  BSS83N  [SOT143-R]
T1215  BSS83N  [SOT143-R]
T1216  BSS83N  [SOT143-R]
T1217  BSS83N  [SOT143-R]
T1218  BSS83N  [SOT143-R]
T1219  BSS83N  [SOT143-R]
T1220  BSS83N  [SOT143-R]
T1221  BSS83N  [SOT143-R]
T1222  BSS83N  [SOT143-R]
T1223  BSS83N  [SOT143-R]
T1224  BSS83N  [SOT143-R]
T1225  FDV301N  [SOT23-3]
T1226  FDV301N  [SOT23-3]
T1227  FDV301N  [SOT23-3]
T1228  FDV301N  [SOT23-3]
T1229  FDV301N  [SOT23-3]
T1230  FDV301N  [SOT23-3]
T1231  FDV301N  [SOT23-3]
T1232  FDV301N  [SOT23-3]
T1233  FDV301N  [SOT23-3]
T1234  FDV301N  [SOT23-3]
T1235  FDV301N  [SOT23-3]
T1236  FDV301N  [SOT23-3]
T1237  FDV301N  [SOT23-3]
T1238  FDV301N  [SOT23-3]
T1239  FDV301N  [SOT23-3]
T1240  FDV301N  [SOT23-3]
T1241  FDV301N  [SOT23-3]
T1242  FDV301N  [SOT23-3]
T1243  FDV301N  [SOT23-3]
T1244  FDV301N  [SOT23-3]
T1245  FDV301N  [SOT23-3]
T1246  FDV301N  [SOT23-3]
T1247  FDV301N  [SOT23-3]
T1248  FDV301N  [SOT23-3]
T1249  FDV301N  [SOT23-3]
T1250  FDV301N  [SOT23-3]
T1251  FDV301N  [SOT23-3]
T1252  BSS83N  [SOT143-R]
T1253  BSS83N  [SOT143-R]
T1254  BSS83N  [SOT143-R]
T1255  BSS83N  [SOT143-R]
T1256  BSS83N  [SOT143-R]
T1257  BSS83N  [SOT143-R]
T1258  BSS83N  [SOT143-R]
T1259  BSS83N  [SOT143-R]
T1260  BSS83N  [SOT143-R]
T1261  BSS83N  [SOT143-R]
T1262  BSS83N  [SOT143-R]
T1263  BSS83N  [SOT143-R]
T1264  FDV301N  [SOT23-3]
T1265  BSS83N  [SOT143-R]
T1266  FDV301N  [SOT23-3]
T1267  FDV301N  [SOT23-3]
T1268  FDV301N  [SOT23-3]
T1269  FDV301N  [SOT23-3]
T1270  FDV301N  [SOT23-3]
T1271  FDV301N  [SOT23-3]
T1272  FDV301N  [SOT23-3]
T1273  FDV301N  [SOT23-3]
T1274  FDV301N  [SOT23-3]
T1275  FDV301N  [SOT23-3]
T1276  FDV301N  [SOT23-3]
T1277  FDV301N  [SOT23-3]
T1278  FDV301N  [SOT23-3]
T1279  FDV301N  [SOT23-3]
T1280  BSS83N  [SOT143-R]
T1281  BSS83N  [SOT143-R]
T1282  BSS83N  [SOT143-R]
T1283  BSS83N  [SOT143-R]
T1284  BSS83N  [SOT143-R]
T1285  BSS83N  [SOT143-R]
T1286  BSS83N  [SOT143-R]
T1287  BSS83N  [SOT143-R]
T1288  BSS83N  [SOT143-R]
T1289  BSS83N  [SOT143-R]
T1290  BSS83N  [SOT143-R]
T1291  BSS83N  [SOT143-R]
T1292  FDV301N  [SOT23-3]
T1293  BSS83N  [SOT143-R]
T1294  BSS83N  [SOT143-R]
T1295  BSS83N  [SOT143-R]
T1296  BSS83N  [SOT143-R]
T1297  BSS83N  [SOT143-R]
T1298  BSS83N  [SOT143-R]
T1299  BSS83N  [SOT143-R]
T1300  BSS83N  [SOT143-R]
T1301  BSS83N  [SOT143-R]
T1302  BSS83N  [SOT143-R]
T1303  BSS83N  [SOT143-R]
T1304  BSS83N  [SOT143-R]
T1305  BSS83N  [SOT143-R]
T1306  BSS83N  [SOT143-R]
T1307  BSS83N  [SOT143-R]
T1308  BSS83N  [SOT143-R]
T1309  BSS83N  [SOT143-R]
T1310  BSS83N  [SOT143-R]
T1311  BSS83N  [SOT143-R]
T1312  BSS83N  [SOT143-R]
T1313  BSS83N  [SOT143-R]
T1314  FDV301N  [SOT23-3]
T1315  FDV301N  [SOT23-3]
T1316  FDV301N  [SOT23-3]
T1317  FDV301N  [SOT23-3]
T1318  FDV301N  [SOT23-3]
T1319  FDV301N  [SOT23-3]
T1320  FDV301N  [SOT23-3]
T1321  FDV301N  [SOT23-3]
T1322  FDV301N  [SOT23-3]
T1323  FDV301N  [SOT23-3]
T1324  FDV301N  [SOT23-3]
T1325  FDV301N  [SOT23-3]
T1326  FDV301N  [SOT23-3]
T1327  FDV301N  [SOT23-3]
T1328  BSS83N  [SOT143-R]
T1329  BSS83N  [SOT143-R]
T1330  BSS83N  [SOT143-R]
T1331  BSS83N  [SOT143-R]
T1332  BSS83N  [SOT143-R]
T1333  BSS83N  [SOT143-R]
T1334  BSS83N  [SOT143-R]
T1335  FDV301N  [SOT23-3]
T1336  FDV301N  [SOT23-3]
T1337  FDV301N  [SOT23-3]
T1338  FDV301N  [SOT23-3]
T1339  FDV301N  [SOT23-3]
T1340  FDV301N  [SOT23-3]
T1341  FDV301N  [SOT23-3]
T1342  FDV301N  [SOT23-3]
T1343  FDV301N  [SOT23-3]
T1344  FDV301N  [SOT23-3]
T1345  BSS83N  [SOT143-R]
T1346  BSS83N  [SOT143-R]
T1347  BSS83N  [SOT143-R]
T1348  BSS83N  [SOT143-R]
T1349  BSS83N  [SOT143-R]
T1350  BSS83N  [SOT143-R]
T1351  BSS83N  [SOT143-R]
T1352  BSS83N  [SOT143-R]
T1353  BSS83N  [SOT143-R]
T1354  BSS83N  [SOT143-R]
T1355  BSS83N  [SOT143-R]
T1356  BSS83N  [SOT143-R]
T1357  BSS83N  [SOT143-R]
T1358  BSS83N  [SOT143-R]
T1359  BSS83N  [SOT143-R]
T1360  FDV301N  [SOT23-3]
T1361  FDV301N  [SOT23-3]
T1362  FDV301N  [SOT23-3]
T1363  FDV301N  [SOT23-3]
T1364  BSS83N  [SOT143-R]
T1365  BSS83N  [SOT143-R]
T1366  BSS83N  [SOT143-R]
T1367  BSS83N  [SOT143-R]
T1368  BSS83N  [SOT143-R]
T1369  BSS83N  [SOT143-R]
T1370  BSS83N  [SOT143-R]
T1371  BSS83N  [SOT143-R]
T1372  BSS83N  [SOT143-R]
T1373  BSS83N  [SOT143-R]